# EAGLE design 32u4 denemesi (EAGLE 7.6.0)
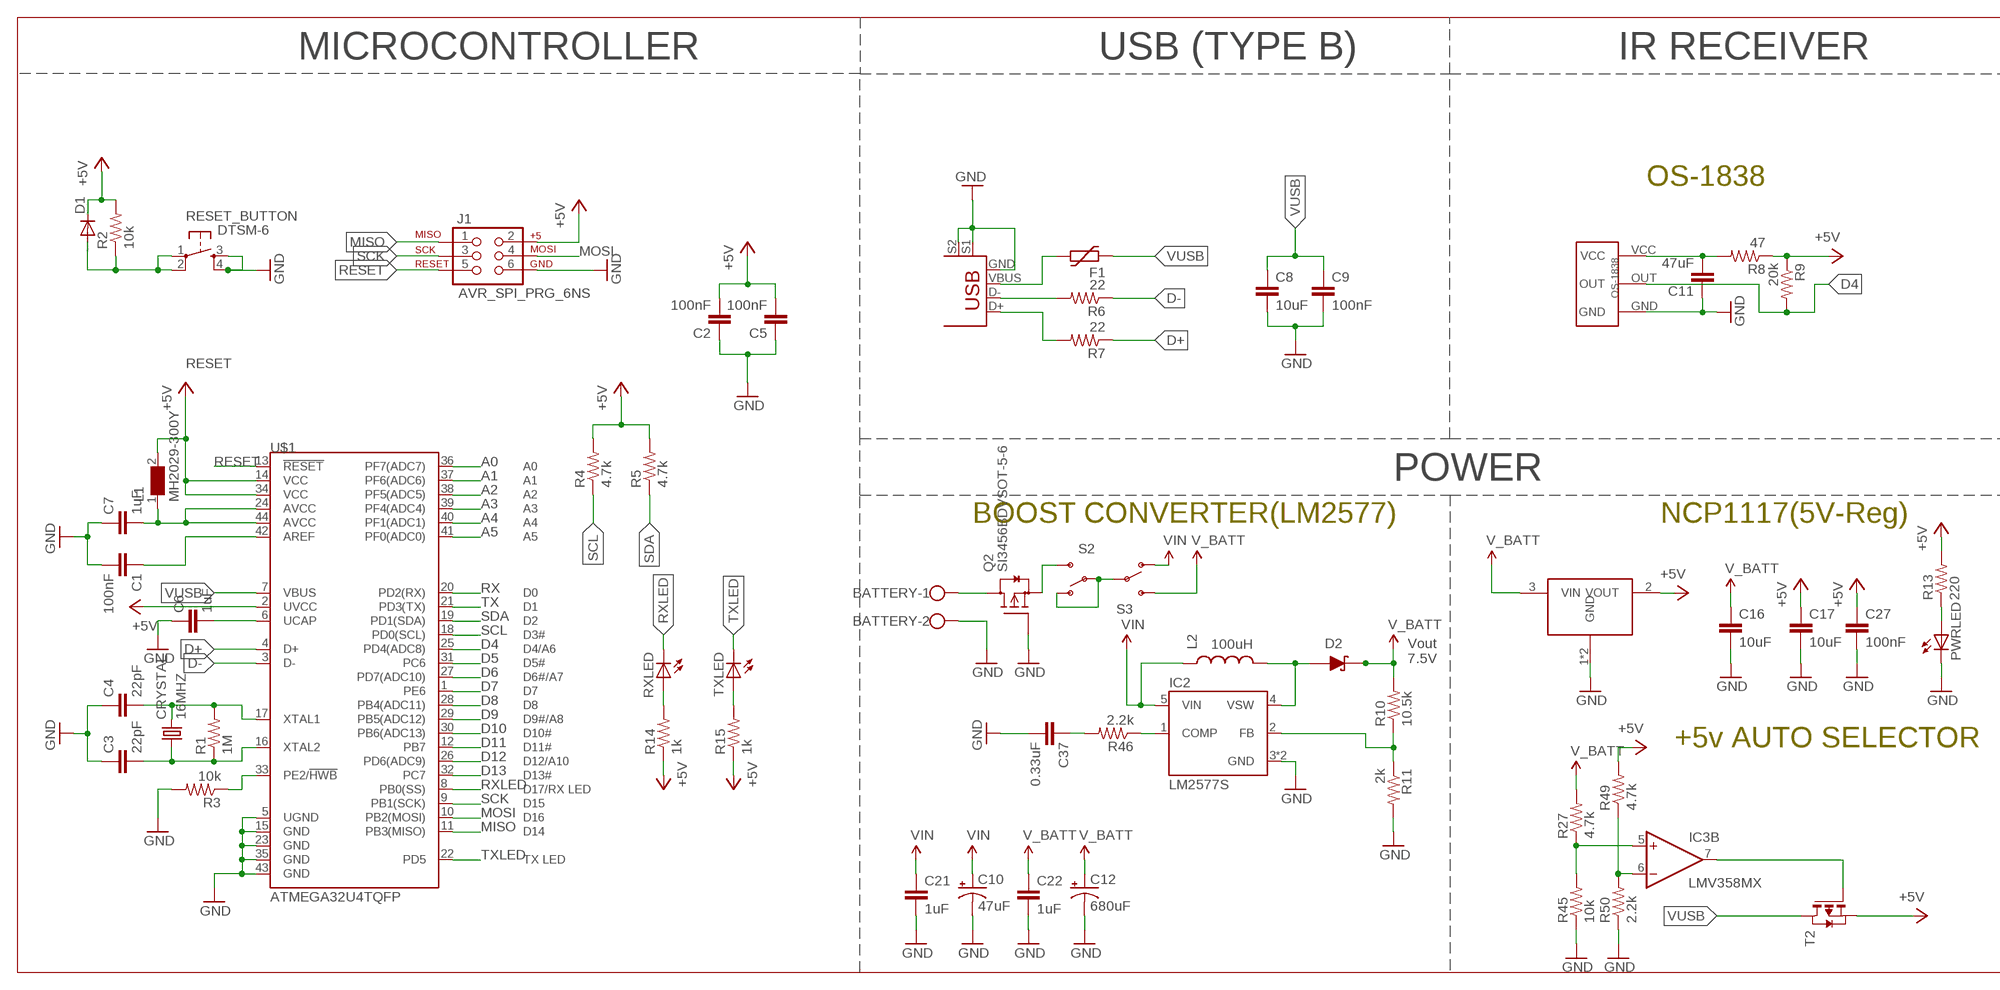
[diagram p0: schematic, sheet 1, part 1 of 2]
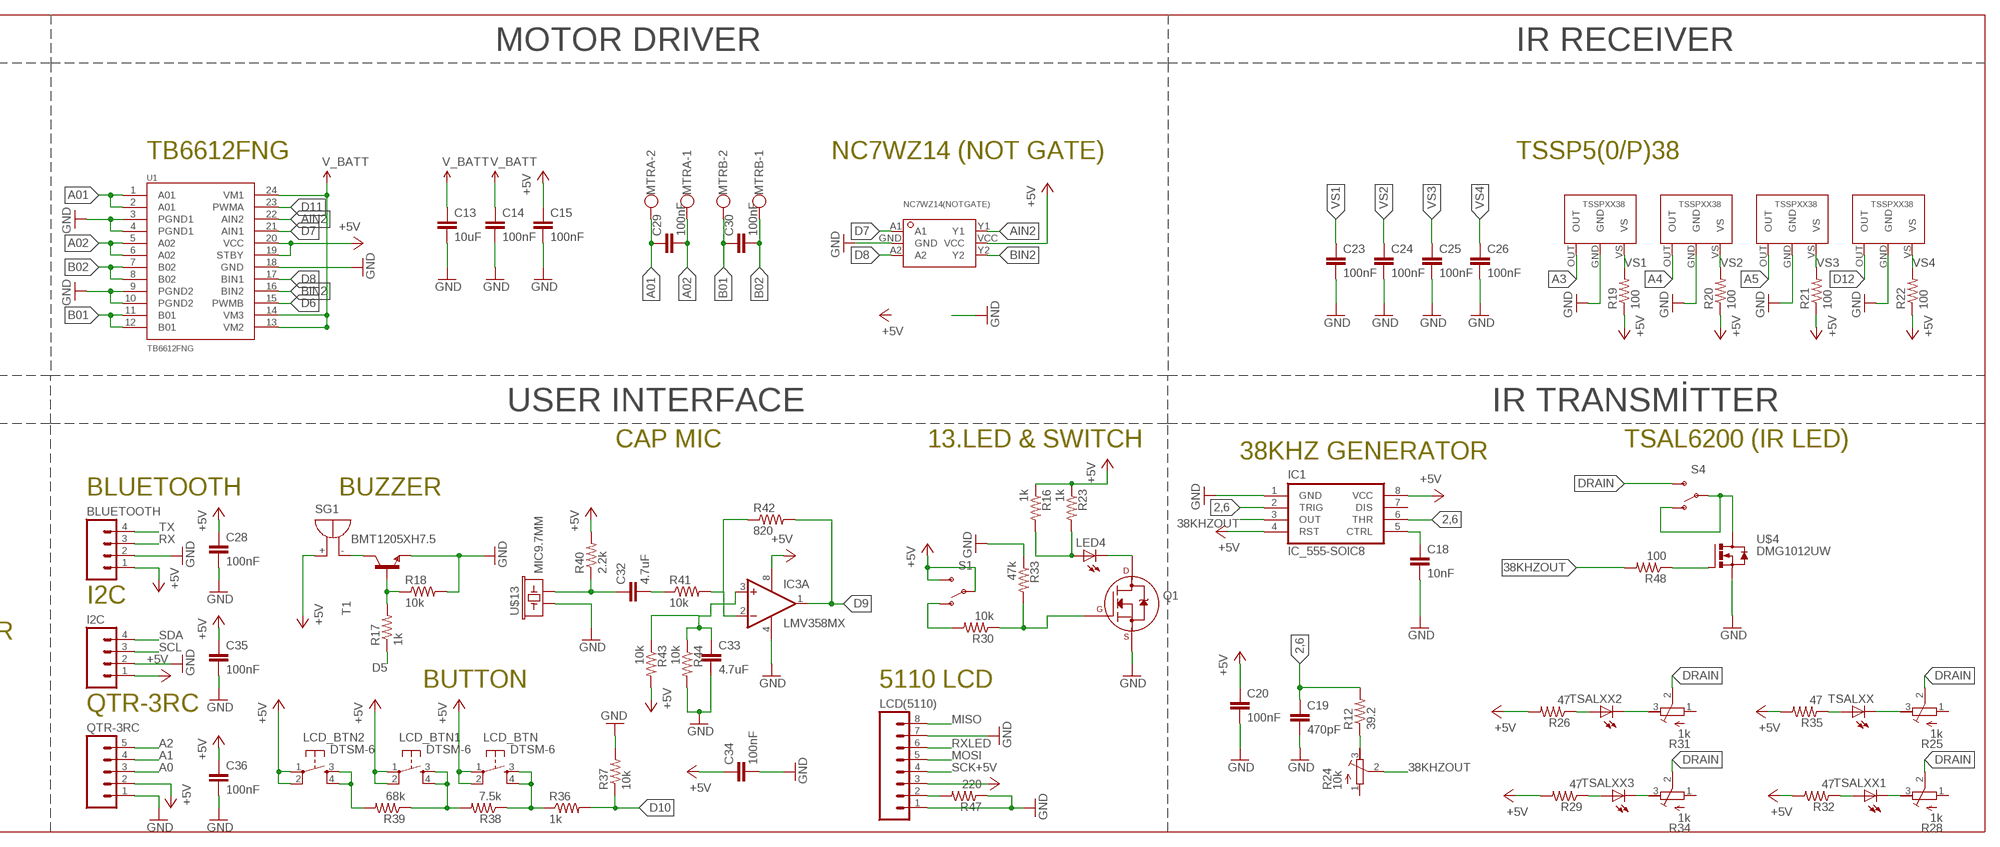
[diagram p1: schematic, sheet 1, part 2 of 2]

## Parts
BATTERY  W237-102  [W237-102]
BLUETOOTH  M04PTH  [1X04]
C1  100nF  CAP1206  [1206]
C2  100nF  CAP1206  [1206]
C3  22pF  CAP1206  [1206]
C4  22pF  CAP1206  [1206]
C5  100nF  CAP1206  [1206]
C6  1uF  CAP1206  [1206]
C7  1uF  CAP1206  [1206]
C8  10uF  CAP1206  [1206]
C9  100nF  CAP1206  [1206]
C10  47uF  CAP_POLF80  [NIPPON_F80]
C11  47uF  CAP1206  [1206]
C12  680uF  CAP_POLG  [PANASONIC_G]
C13  10uF  CAP1206  [1206]
C14  100nF  CAP1206  [1206]
C15  100nF  CAP1206  [1206]
C16  10uF  CAP1206  [1206]
C17  10uF  CAP1206  [1206]
C18  10nF  CAP1206  [1206]
C19  470pF  CAP1206  [1206]
C20  100nF  CAP1206  [1206]
C21  1uF  CAP1206  [1206]
C22  1uF  CAP1206  [1206]
C23  100nF  CAP1206  [1206]
C24  100nF  CAP1206  [1206]
C25  100nF  CAP1206  [1206]
C26  100nF  CAP1206  [1206]
C27  100nF  CAP1206  [1206]
C28  100nF  CAP1206  [1206]
C29  100nF  CAP1206  [1206]
C30  100nF  CAP1206  [1206]
C32  4.7uF  CAP1206  [1206]
C33  4.7uF  CAP1206  [1206]
C34  100nF  CAP1206  [1206]
C35  100nF  CAP1206  [1206]
C36  100nF  CAP1206  [1206]
C37  0.33uF  CAP1206  [1206]
CRYSTAL  16MHZ  CRYSTAL5X3  [CRYSTAL-SMD-5X3]
D1  DIODE-MINIMELF  [MINIMELF]
D2  D_SCHOTTKYA  [SMA]
F1  FUSE_PTC-0805  [PTC0805]
I2C  M04PTH  [1X04]
IC1  IC_555-SOIC8  [SOIC-8]
IC2  LM2577S  [TO263-5]
IC3  LMV358MX  [SO08]
J1  AVR_SPI_PRG_6NS  [2X3-NS]
L1  MH2029-300Y  WE-CBF_0805  [0805]
L2  INDUCTORPWR  [CDRH125]
LCD(5110)  M081X08  [1X08]
LCD_BTN  DTSM-6  [DTSM-6]
LCD_BTN1  DTSM-6  [DTSM-6]
LCD_BTN2  DTSM-6  [DTSM-6]
LED4  LEDCHIPLED_0805  [CHIPLED_0805]
MTRA  W237-102  [W237-102]
MTRB  W237-102  [W237-102]
PWRLED  LEDCHIPLED_0805  [CHIPLED_0805]
Q1  2N7000_SOT23  [SOT-23]
Q2  SI3456BDVSOT-5-6  [SOT23-6]
QTR-3RC  M05PTH  [1X05]
R1  1M  RESISTOR1206  [1206]
R2  10k  RESISTOR1206  [1206]
R3  10k  RESISTOR1206  [1206]
R4  4.7k  RESISTOR1206  [1206]
R5  4.7k  RESISTOR1206  [1206]
R6  22  RESISTOR1206  [1206]
R7  22  RESISTOR1206  [1206]
R8  47  RESISTOR1206  [1206]
R9  20k  RESISTOR1206  [1206]
R10  10.5k  RESISTOR1206  [1206]
R11  2k  RESISTOR1206  [1206]
R12  39.2  RESISTOR1206  [1206]
R13  220  RESISTOR1206  [1206]
R14  1k  RESISTOR1206  [1206]
R15  1k  RESISTOR1206  [1206]
R16  1k  RESISTOR1206  [1206]
R17  1k  RESISTOR1206  [1206]
R18  10k  RESISTOR1206  [1206]
R19  100  RESISTOR1206  [1206]
R20  100  RESISTOR1206  [1206]
R21  100  RESISTOR1206  [1206]
R22  100  RESISTOR1206  [1206]
R23  1k  RESISTOR1206  [1206]
R24  10k  R-TRIMM3296W  [RTRIM3296W]
R25  1k  R-TRIMM3296W  [RTRIM3296W]
R26  47  RESISTOR1206  [1206]
R27  4.7k  RESISTOR1206  [1206]
R28  1k  R-TRIMM3296W  [RTRIM3296W]
R29  47  RESISTOR1206  [1206]
R30  10k  RESISTOR1206  [1206]
R31  1k  R-TRIMM3296W  [RTRIM3296W]
R32  47  RESISTOR1206  [1206]
R33  47k  RESISTOR1206  [1206]
R34  1k  R-TRIMM3296W  [RTRIM3296W]
R35  47  RESISTOR1206  [1206]
R36  1k  RESISTOR1206  [1206]
R37  10k  RESISTOR1206  [1206]
R38  7.5k  RESISTOR1206  [1206]
R39  68k  RESISTOR1206  [1206]
R40  2.2k  RESISTOR1206  [1206]
R41  10k  RESISTOR1206  [1206]
R42  820  RESISTOR1206  [1206]
R43  10k  RESISTOR1206  [1206]
R44  10k  RESISTOR1206  [1206]
R45  10k  RESISTOR1206  [1206]
R46  2.2k  RESISTOR1206  [1206]
R47  220  RESISTOR1206  [1206]
R48  100  RESISTOR1206  [1206]
R49  4.7k  RESISTOR1206  [1206]
R50  2.2k  RESISTOR1206  [1206]
RESET_BUTTON  DTSM-6  [DTSM-6]
RXLED  LEDCHIPLED_0805  [CHIPLED_0805]
S1  SWITCH-SPDTPTH  [SWITCH-SPDT]
S2  SWITCH-SPDTPTH  [SWITCH-SPDT]
S3  SWITCH-SPDTPTH  [SWITCH-SPDT]
S4  SWITCH-SPDTPTH  [SWITCH-SPDT]
SG1  BMT1205XH7.5  [BMT1205XH7.5]
T1  MMBT2222ALT1-NPN-SOT23-BEC  [SOT23-BEC]
T2  PMOSSOT23  [SOT-23]
TSALXX  LED5MM  [LED5MM]
TSALXX1  LED5MM  [LED5MM]
TSALXX2  LED5MM  [LED5MM]
TSALXX3  LED5MM  [LED5MM]
TXLED  LEDCHIPLED_0805  [CHIPLED_0805]
U1  TB6612FNG  TB6621FNG  [SSOP24]
U$1  ATMEGA32U4TQFP  [SPARKFUN-DIGITALIC_TQFP44]
U$2  USB+SHIELD  [USB-B-PTH]
U$3  OS-1838  [OS-1838]
U$4  DMG1012UW  [SOT323]
U$5  NCP1117  [SOT223]
U$6  TSSPXX38  [TSSPXX38]
U$7  TSSPXX38  [TSSPXX38]
U$8  TSSPXX38  [TSSPXX38]
U$9  TSSPXX38  [TSSPXX38]
U$10  NC7WZ14(NOTGATE)  [SC-70-6]
U$13  MIC9.7MM  [MIC-9.7MM]

## Nets
2,6: C19.1 IC1.2(TRIG) IC1.6(THR) R12.2
38KHZOUT: IC1.3(OUT) R24.2(S) R48.2
+5V: BLUETOOTH.1 C2.2 C5.2 C15.1 C17.1 C20.1 C27.1 C28.1 C34.1 C35.1 C36.1 D1.C I2C.1 IC1.4(RST) IC1.8(VCC) IC3.8(P:V+) J1.2 L1.2 LCD(5110).3 LCD_BTN1.1 LCD_BTN1.2 LCD_BTN2.1 LCD_BTN2.2 LCD_BTN.1 LCD_BTN.2 QTR-3RC.2 R2.2 R4.2 R5.2 R8.1 R9.1 R13.2 R14.1 R15.1 R16.1 R19.1 R20.1 R21.1 R22.1 R23.1 R26.2 R29.2 R32.2 R35.2 R40.2 R43.2 R49.2 S1.2(P) S1.3(S) SG1.+ T2.2(S) U1.19(STBY) U1.20(VCC) U$1.2(UVCC) U$1.14(VCC) U$1.34(VCC) U$5.2(VOUT) U$10.VCC
A0: QTR-3RC.3 U$1.36(PF7(ADC7))
A1: QTR-3RC.4 U$1.37(PF6(ADC6))
A01 [supply]: C29.1 MTRA.2 U1.1(A01) U1.2(A01)
A2: QTR-3RC.5 U$1.38(PF5(ADC5))
A02 [supply]: C29.2 MTRA.1 U1.5(A02) U1.6(A02)
A3: U$1.39(PF4(ADC4)) U$9.OUT
A4: U$1.40(PF1(ADC1)) U$8.OUT
A5: U$1.41(PF0(ADC0)) U$7.OUT
AIN2: U1.22(AIN2) U$10.Y1
B01 [supply]: C30.1 MTRB.2 U1.11(B01) U1.12(B01)
B02 [supply]: C30.2 MTRB.1 U1.7(B02) U1.8(B02)
BIN2: U1.16(BIN2) U$10.Y2
CTRL: C18.1 IC1.5(CTRL)
D4: R9.2 U$1.25(PD4(ADC8)) U$3.OUT
D5: R17.1 U$1.31(PC6)
D6: U1.15(PWMB) U$1.27(PD7(ADC10))
D7: U1.21(AIN1) U$1.1(PE6) U$10.A1
D8: U1.17(BIN1) U$1.28(PB4(ADC11)) U$10.A2
D9: IC3.1(A:OUT) R42.2 U$1.29(PB5(ADC12))
D10: R36.2 R37.1 U$1.30(PB6(ADC13))
D11: U1.23(PWMA) U$1.12(PB7)
D12: U$1.26(PD6(ADC9)) U$6.OUT
D13: U$1.32(PC7)
D+: R7.1 U$1.4(D+)
D-: R6.1 U$1.3(D-)
DRAIN: R25.2(S) R28.2(S) R31.2(S) R34.2(S) S4.3(S)
GND: BATTERY.2 BLUETOOTH.2 C1.2 C2.1 C3.1 C4.1 C5.1 C6.1 C7.1 C8.2 C9.2 C10.- C11.1 C12.- C13.2 C14.2 C15.2 C16.2 C17.2 C18.2 C19.2 C20.2 C21.2 C22.2 C23.2 C24.2 C25.2 C26.2 C27.2 C28.2 C33.2 C34.2 C35.2 C36.2 C37.2 I2C.2 IC1.1(GND) IC2.3(GND) IC2.6(GND) IC3.4(P:V-) J1.6 LCD(5110).1 LCD(5110).7 PWRLED.C Q1.2(S) Q2.3(G) QTR-3RC.1 R3.2 R11.2 R18.2 R33.1 R37.2 R44.2 R45.1 R47.1 R50.1 RESET_BUTTON.3 RESET_BUTTON.4 T1.E U1.3(PGND1) U1.4(PGND1) U1.9(PGND2) U1.10(PGND2) U1.18(GND) U$1.5(UGND) U$1.15(GND) U$1.23(GND) U$1.35(GND) U$1.43(GND) U$2.GND U$2.S1 U$2.S2 U$3.GND U$4.2(S) U$5.1(GND) U$5.4(GND) U$6.GND U$7.GND U$8.GND U$9.GND U$10.GND U$13.1
MISO: J1.1 LCD(5110).8 U$1.11(PB3(MISO))
MOSI: J1.4 LCD(5110).5 U$1.10(PB2(MOSI))
N$1 [supply]: C7.2 L1.1 U$1.24(AVCC) U$1.44(AVCC)
N$2: C1.1 U$1.42(AREF)
N$3 [supply]: C6.2 U$1.6(UCAP)
N$4: C4.2 CRYSTAL.3 R1.2 U$1.17(XTAL1)
N$5: C3.2 CRYSTAL.1 R1.1 U$1.16(XTAL2)
N$6: F1.2 U$2.VBUS
N$7: R3.1 U$1.33(PE2/!HWB)
N$8: LCD_BTN2.3 LCD_BTN2.4 R39.2
N$9: R6.2 U$2.D-
N$10: R7.2 U$2.D+
N$11: IC3.5(B:+IN) R27.1 R45.2
N$12: C11.2 R8.2 U$3.VCC
N$14: PWRLED.A R13.1
N$15 [supply]: IC2.2(FB) R10.1 R11.1
N$16: R48.1 U$4.1(G)
N$17: LCD_BTN.3 LCD_BTN.4 R36.1 R38.1
N$18: LCD_BTN1.3 LCD_BTN1.4 R38.2 R39.1
N$19: C32.1 R40.1 U$13.2
N$20: C32.2 R41.1
N$21: IC3.2(A:-IN) R41.2 R42.1
N$22: R14.2 RXLED.A
N$23: R15.2 TXLED.A
N$24: LED4.A R16.2 R23.2
N$25: R17.2 R18.1 T1.B
N$26: IC3.6(B:-IN) R49.1 R50.2
N$27: SG1.- T1.C
N$28: IC3.7(B:OUT) T2.3(G)
N$29: R12.1 R24.3(A)
N$31: S4.1(O) S4.2(P) U$4.3(D)
N$33: R25.3(A) TSALXX.K(C)
N$34: R35.1 TSALXX.A
N$35: LED4.C Q1.3(D)
N$37: R28.3(A) TSALXX1.K(C)
N$38: R32.1 TSALXX1.A
N$39: R30.2 S1.1(O)
N$40: Q1.1(G) R30.1 R33.2
N$41: R31.3(A) TSALXX2.K(C)
N$42: R26.1 TSALXX2.A
N$45: R34.3(A) TSALXX3.K(C)
N$46: R29.1 TSALXX3.A
N$49: BATTERY.1 Q2.1(D) Q2.2(D) Q2.5(D) Q2.6(D)
N$50: C33.1 IC3.3(A:+IN) R43.1 R44.1
N$51: Q2.4(S) S2.3(S)
N$52 [supply]: IC2.1(COMP) R46.1
N$53: C37.1 R46.2
N$54 [supply]: S2.1(O) S2.2(P) S3.2(P)
N$55: LCD(5110).2 R47.2
RESET: D1.A J1.5 R2.1 RESET_BUTTON.1 RESET_BUTTON.2 U$1.13(!RESET)
RX: BLUETOOTH.3 U$1.20(PD2(RX))
RXLED: LCD(5110).6 RXLED.C U$1.8(PB0(SS))
SCK: J1.3 LCD(5110).4 U$1.9(PB1(SCK))
SCL: I2C.3 R4.1 U$1.18(PD0(SCL))
SDA: I2C.4 R5.1 U$1.19(PD1(SDA))
TX: BLUETOOTH.4 U$1.21(PD3(TX))
TXLED: TXLED.C U$1.22(PD5)
V_BATT [supply]: C12.+ C13.1 C14.1 C16.1 C22.1 D2.1(C) R10.2 R27.2 S3.3(S) U1.13(VM2) U1.14(VM3) U1.24(VM1) U$5.3(VIN)
VIN [supply]: C10.+ C21.1 IC2.5(VIN) L2.1 S3.1(O)
VS1: C23.1 R19.2 U$9.VS
VS2: C24.1 R20.2 U$8.VS
VS3: C25.1 R21.2 U$7.VS
VS4: C26.1 R22.2 U$6.VS
VSW [supply]: D2.2(A) IC2.4(VSW) L2.2
VUSB [supply]: C8.1 C9.1 F1.1 T2.1(D) U$1.7(VBUS)
Unconnected: IC1.7(DIS) R24.1(E) R25.1(E) R28.1(E) R31.1(E) R34.1(E)

## Notes on the sheet
- MICROCONTROLLER | USB (TYPE B) | IR RECEIVER | MOTOR DRIVER | IR RECEIVER
- OS-1838 | TB6612FNG | NC7WZ14 (NOT GATE) | TSSP5(0/P)38
- POWER | USER INTERFACE | IR TRANSMİTTER
- BOOST CONVERTER(LM2577) | NCP1117(5V-Reg) | CAP MIC | 13.LED & SWITCH | TSAL6200 (IR LED)
- 38KHZ GENERATOR
- BLUETOOTH | BUZZER
- 100uH
- Vout
  7.5V
- I2C
- +5v AUTO SELECTOR
- BUTTON | 5110 LCD
- QTR-3RC

## Library data of the parts
BATTERY MTRA MTRB = con-wago-500:W237-102: WAGO SCREW CLAMP; MPN: 237-102; OC_FARNELL: unknown; OC_NEWARK: 70K9898
BLUETOOTH I2C = SparkFun-Connectors:M04: Header 4 Standard 4-pin 0.1" header. Use with straight break away headers (SKU : PRT-00116), right angle break away headers (PRT-00553), swiss pins (PRT-00743), machine pins (PRT-00117), and female headers (PRT-00115). Molex polarized connector foot print use with SKU : PRT-08231 with associated crimp pins and housings. 1MM SMD Version SKU: PRT-10208
C1-C9 C11 C13-C30 C32-C37 = SparkFun-Passives:CAP: Capacitor Standard 0603 ceramic capacitor, and 0.1" leaded capacitor.
C10 C12 = SparkFun-Passives:CAP_POL: Capacitor Polarized These are standard SMD and PTH capacitors. Normally 10uF, 47uF, and 100uF in electrolytic and tantalum varieties. Always verify the external diameter of the through hole cap, it varies with capacity, voltage, and manufacturer. The EIA devices should be standard.
CRYSTAL = SparkFun-FreqCtrl:CRYSTAL: Various standard crystals. Proven footprints. Spark Fun Electronics SKU : COM-00534
D1 = diode:DIODE-: DIODE
D2 = m-pad-2.1:D_SCHOTTKY: Schottky diodes in various packages
F1 = dp_devices:FUSE_PTC: Resettable PTC
IC1 = dp_devices:IC_555: Classic 555 IC
IC2 = v-reg-3:LM2577: National Semiconductor <http://www.national.com> 3.0A Step-Up "Simple Switcher"(c) 3.0A 65V NPN switch, step-up regulator
IC3 = linear:LMV358?*: Dual General Purpose, Low Voltage, Rail-to-Rail Output Operational Amplifiers Source: http://www.national.com/mpf/LM/LMV321.html http://www.national.com/dt/lmv_qual.pdf
J1 = SparkFun-Connectors:AVR_SPI_PRG_6: AVR ISP 6 Pin This is the reduced ISP connector for AVR programming. Common on Arduino. This footprint will take up less PCB space and can be used with a 10-pin to 6-pin adapter such as SKU: BOB-08508
L1 = wuerth_elektronik_v5:WE-CBF: SMD EMI Suppression Ferrite Beads - excellent anti-EMI properties - low DCR - impedances till 3000 ohms - rated current up to 6 A
L2 = SparkFun-Passives:INDUCTOR: Inductors Basic Inductor/Choke - 0603 and 1206. Footprints are not proven and vary greatly between part numbers. SRN6045- 33uH, 20% 1.4A SDR0403-560KL - 56uH, 10%, 500mA RMS/740mA peak
LCD(5110) = SparkFun-Connectors:M08: Header 8 Standard 8-pin 0.1" header. Use with straight break away headers (SKU : PRT-00116), right angle break away headers (PRT-00553), swiss pins (PRT-00743), machine pins (PRT-00117), and female headers (PRT-00115).
LCD_BTN LCD_BTN1 LCD_BTN2 RESET_BUTTON = switch-tact:DTSM-6
LED4 PWRLED RXLED TSALXX TSALXX1-TSALXX3 TXLED = led:LED: LED OSRAM: - CHIPLED LG R971, LG N971, LY N971, LG Q971, LY Q971, LO R971, LY R971 LH N974, LH R974 LS Q976, LO Q976, LY Q976 LO Q996 - Hyper CHIPLED LW Q18S LB Q993, LB Q99A, LB R99A - SideLED LS A670, LO A670, LY A670, LG A670, LP A670 LB A673, LV A673, LT A673, LW A673 LH A674 LY A675 LS A676, LA A676, LO A676, LY A676, LW A676 LS A679, LY A679, LG A679 - Hyper Micro SIDELED® LS Y876, LA Y876, LO Y876, LY Y876 LT Y87S - SmartLED LW L88C, LW L88S LB L89C, LB L89S, LG L890 LS L89K, LO L89K, LY L89K LS L896, LA L896, LO L896, LY L896 - TOPLED LS T670, LO T670, LY T670, LG T670, LP T670 LSG T670, LSP T670, LSY T670, LOP T670, LYG T670 LG T671, LOG T671, LSG T671 LB T673, LV T673, LT T673, LW T673 LH T674 LS T676, LA T676, LO T676, LY T676, LB T676, LH T676, LSB T676, LW T676 LB T67C, LV T67C, LT T67C, LS T67K, LO T67K, LY T67K, LW E67C LS E67B, LA E67B, LO E67B, LY E67B, LB E67C, LV E67C, LT E67C LW T67C LS T679, LY T679, LG T679 LS T770, LO T770, LY T770, LG T770, LP T770 LB T773, LV T773, LT T773, LW T773 LH T774 LS E675, LA E675, LY E675, LS T675 LS T776, LA T776, LO T776, LY T776, LB T776 LHGB T686 LT T68C, LB T68C - Hyper Mini TOPLED® LB M676 - Mini TOPLED Santana® LG M470 LS M47K, LO M47K, LY M47K Source: http://www.osram.convergy.de LUXEON: - LUMILED® LXK2-PW12-R00, LXK2-PW12-S00, LXK2-PW14-U00, LXK2-PW14-V00 LXK2-PM12-R00, LXK2-PM12-S00, LXK2-PM14-U00 LXK2-PE12-Q00, LXK2-PE12-R00, LXK2-PE12-S00, LXK2-PE14-T00, LXK2-PE14-U00 LXK2-PB12-K00, LXK2-PB12-L00, LXK2-PB12-M00, LXK2-PB14-N00, LXK2-PB14-P00, LXK2-PB14-Q00 LXK2-PR12-L00, LXK2-PR12-M00, LXK2-PR14-Q00, LXK2-PR14-R00 LXK2-PD12-Q00, LXK2-PD12-R00, LXK2-PD12-S00 LXK2-PH12-R00, LXK2-PH12-S00 LXK2-PL12-P00, LXK2-PL12-Q00, LXK2-PL12-R00 Source: www.luxeon.com KINGBRIGHT: KA-3528ASYC Source: www.kingbright.com
Q1 = transistors:2N700*: 2N7000, 2N7002, NDS7002A N-channel enhancement mode MOSFET
Q2 = m-pad-2.1:SI3456BDV: Vishay Siliconix Si3456BDVY N-Channel 30-V (D-S) MOSFET FEATURES: TrenchFET Power MOSFET 100% Rg Tested Please send any comments to: messi@users.sourceforge.net
QTR-3RC = SparkFun-Connectors:M05: Header 5 Standard 5-pin 0.1" header. Use with straight break away headers (SKU : PRT-00116), right angle break away headers (PRT-00553), swiss pins (PRT-00743), machine pins (PRT-00117), and female headers (PRT-00115). Molex polarized connector foot print use with SKU : PRT-08230 with associated crimp pins and housings.
R1-R23 R26 R27 R29 R30 R32 R33 R35-R50 = SparkFun-Resistors:RESISTOR: Resistor Basic schematic elements and footprints for 0603, 1206, and PTH resistors.
R24 R25 R28 R31 R34 = resistor:R-TRIMM: Trimm resistor
S1-S4 = SparkFun-Electromechanical:SWITCH-SPDT: SPDT Switch Simple slide switch, Spark Fun Electronics SKU : COM-00102 DPDT SMT slide switch, AYZ0202, SWCH-08179
SG1 = buzzer:BMT1205XH7.5: MAGNETIC TRANSDUCER Source: Http:www.be-star.com; OC_FARNELL: unknown; OC_NEWARK: unknown
T1 = transistor:*-NPN-: NPN Transistror BF959 corrected 2008.03.06
T2 = zetex:PMOSSOT23: MOS FET; OC_FARNELL: unknown; OC_NEWARK: unknown
U1 = SparkFun-PowerIC:TB6621FNG: Toshiba 1A dual motor driver IC-09363; PROD_ID: IC-09363
U$1 = SparkFun-DigitalIC:ATMEGA32U4: Atmel 44-pin 8-bit Microcontroller with 32KBytes of ISP Flash and USB Controller ----- Please use the QFN-44-NOPAD_1:1 package for the footprint of all boards using a 32U4. Route traces directly away from the pads as much as possible.; PROD_ID: IC-11161
U$2 = SparkFun-Connectors:USB+SHIELD: USB+Shield USB connector with shield pins connectable
U$3 = HACIBİDEAS:OS-1838
U$4 = m-pad-2.1:DMG1012UW
U$5 = SparkFun-PowerIC:NCP1117
U$6-U$9 = HACIBİDEAS:TSSPXX38
U$10 = m-pad-2.1:NC7WZ14(NOTGATE)
U$13 = SparkFun-Sensors:MIC: Omni-directional electret microphone. 9.7mm standard diameter.; PROD_ID: COMP-08856

## Module TSSSP
Ports: 

### Library data of the parts

## Net classes
0 default: width 0.406 mm, drill 0.254 mm, clearance 0.203 mm
1 supply: width 0.406 mm, drill 0.254 mm, clearance 0.203 mm

## Board
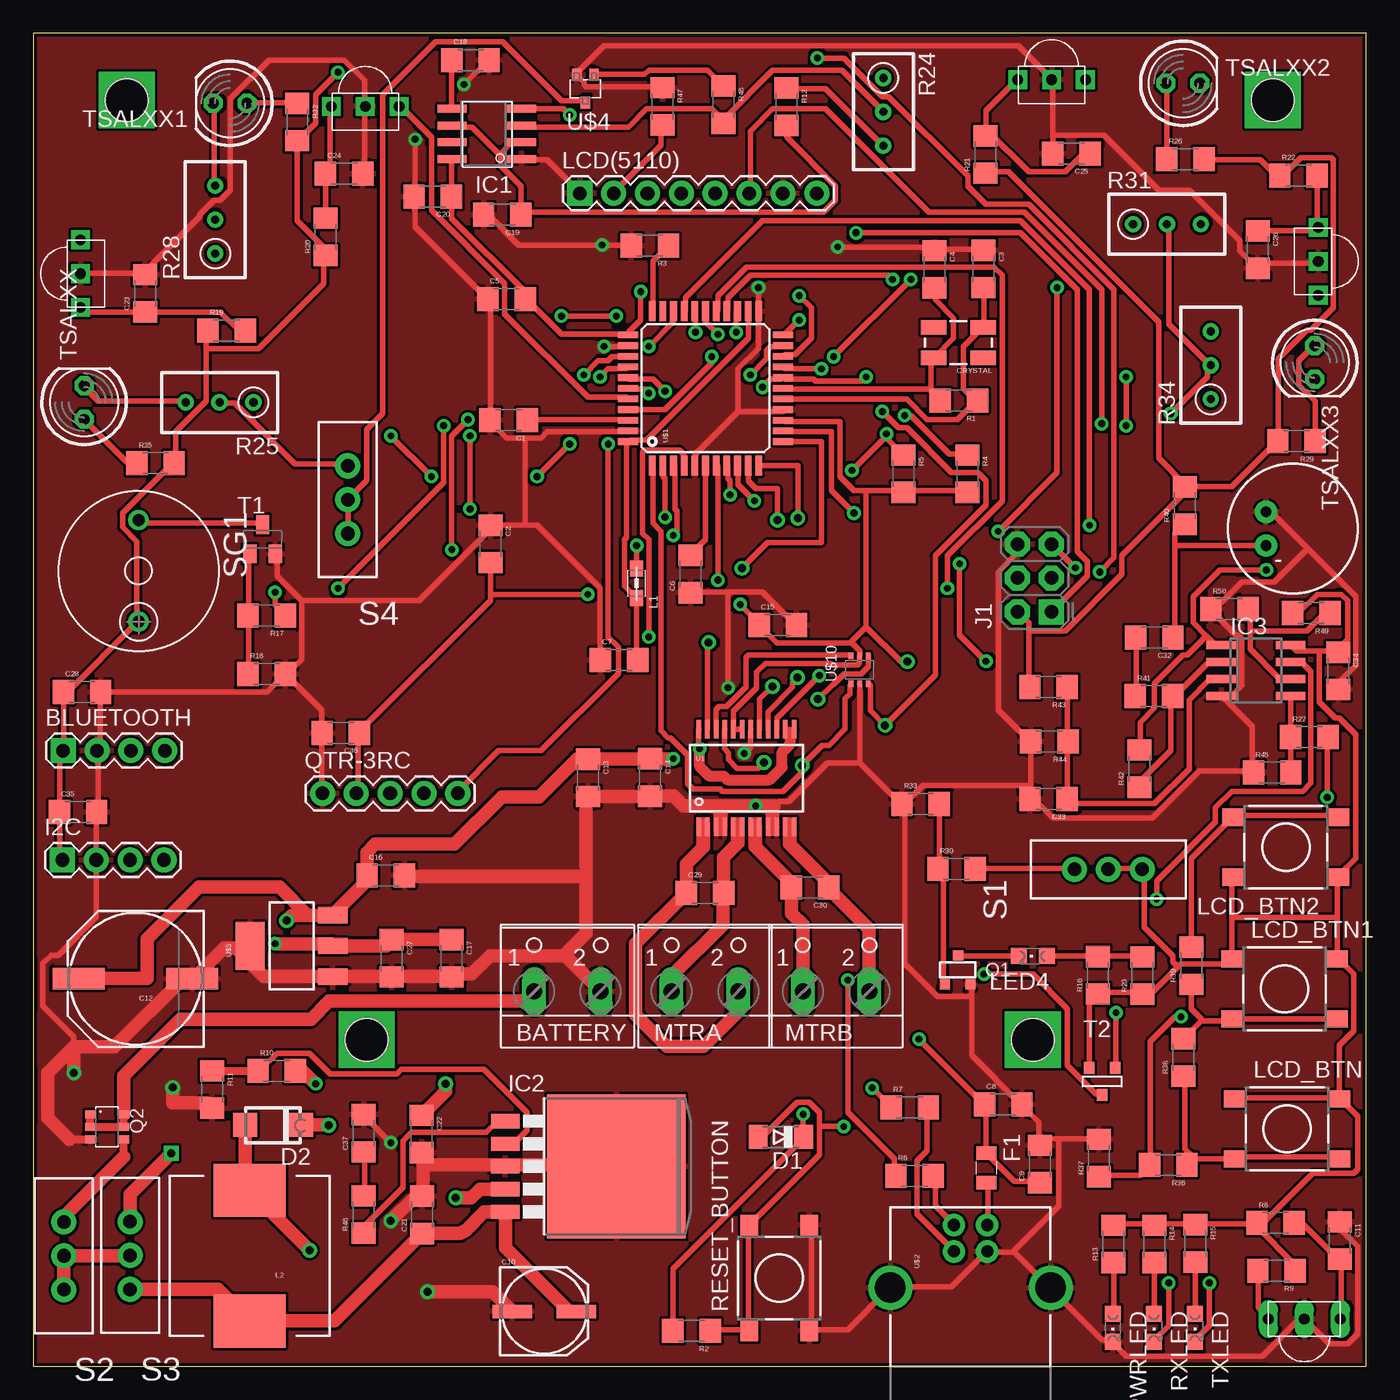
[diagram p2: board, top side]
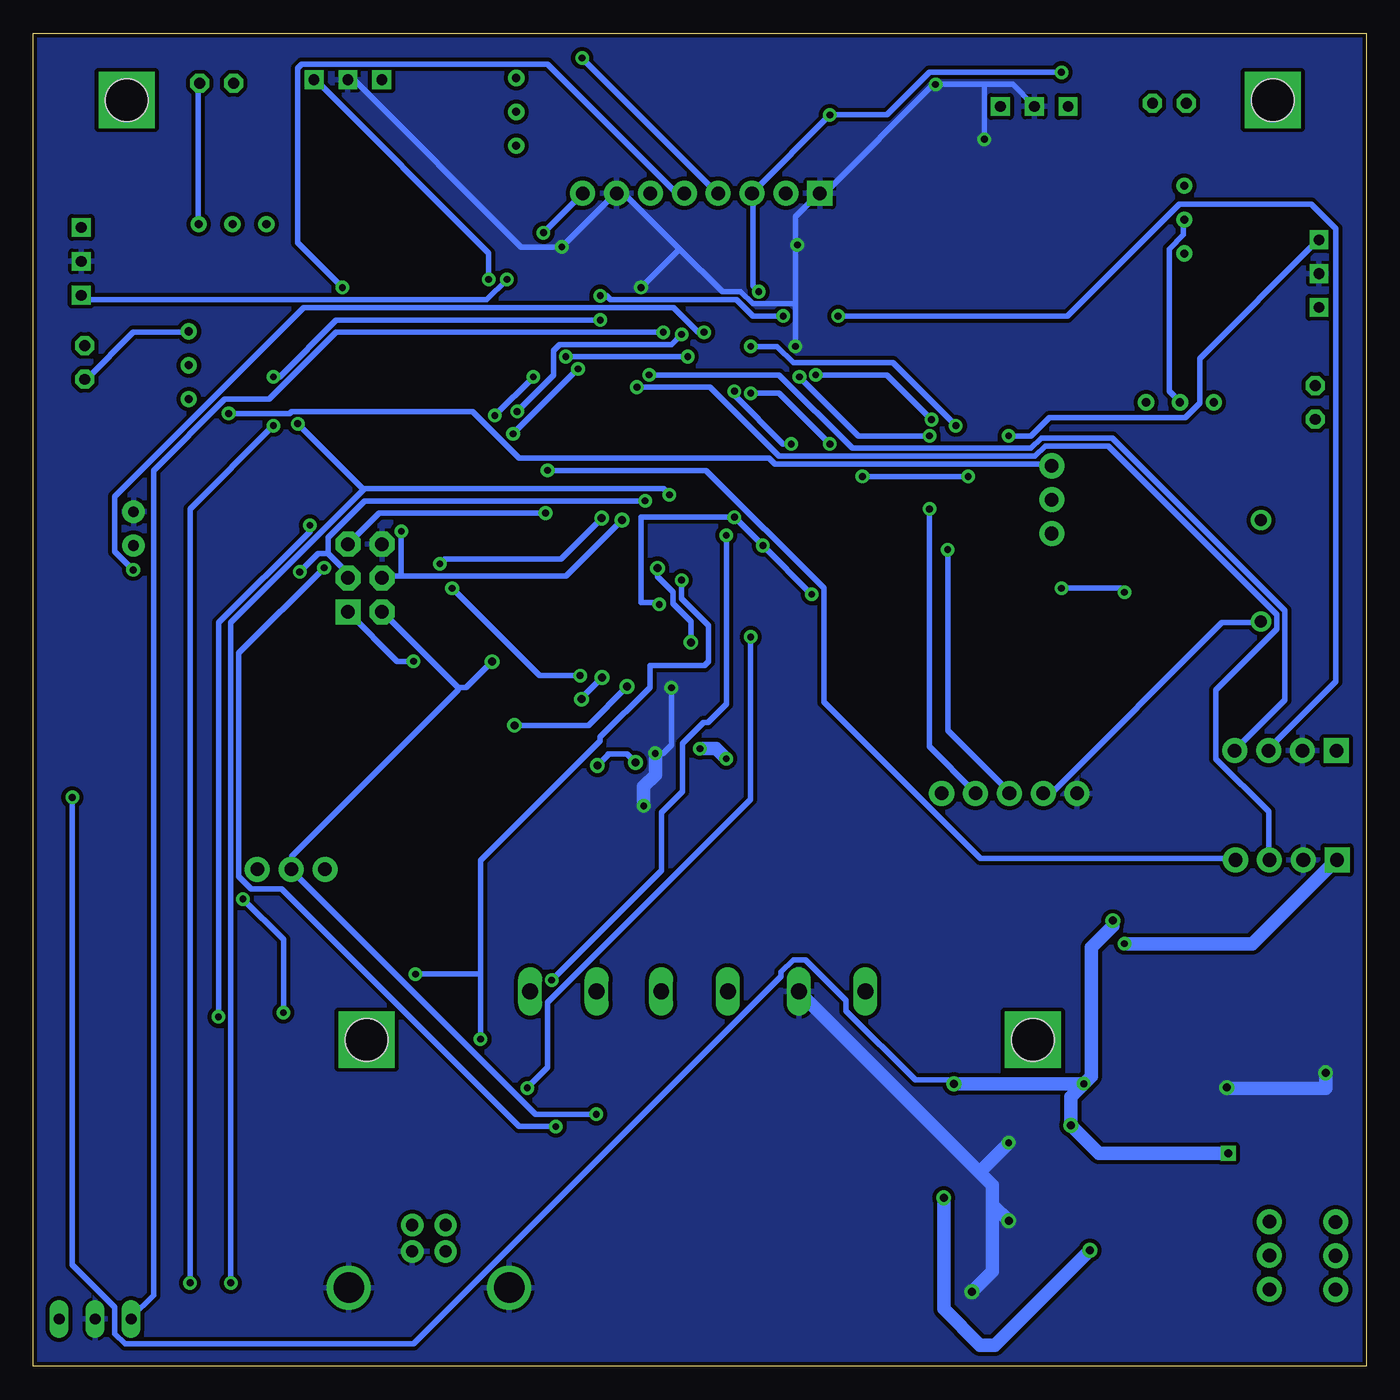
[diagram p3: board, bottom side, seen from below]

Size 100 x 100 mm. Coordinates in mm from the lower left corner, seen from the top.
Outline: 0,0 100,0 100,100 0,100 0,0
Copper layers (1*16): Top 0.035mm / dielectric 1.5mm / Bottom 0.035mm
Design rules "SparkFun": minimum track width 8mil, minimum drill 20mil, track to track 8mil, track to pad 8mil, pad to pad 8mil, via to via 8mil, smd to smd 8mil, copper to edge 10mil, drill to drill 8mil, minimum pad ring 12mil, minimum via ring 10mil, stop-mask expansion 4mil, vias tented up to drill 25mil, thermal gap 10mil
Holes 3.2 mm at 7,95 93,95 25,24.5 75,24.5

### Footprints (pad centres in the part's own frame; a part is rotated, then mirrored left to right if it is on the bottom)
W237-102 = drill 1.194 long: 1 -2.5,-1.27; 2 2.5,-1.27
1X04 = drill 1.016 pad 1.88 square: 1 0,0 | drill 1.016 pad 1.88: 2 2.54,0; 3 5.08,0; 4 7.62,0
1206 = smd 1.6 x 1.8: 1 -1.4,0; 2 1.4,0
NIPPON_F80 = smd 2.95 x 1: + 2.4,0; - -2.4,0
PANASONIC_G = smd 3.9 x 1.6: + 4.25,0; - -4.25,0
CRYSTAL-SMD-5X3 = smd 1.9 x 1.1: 1 -1.85,-1.15; 2 1.85,-1.15; 3 1.85,1.15; 4 -1.85,1.15
MINIMELF = smd 1.4 x 1.8: A 1.7,0; C -1.7,0
SMA = smd 1.8 x 1.8: 1 -2.1,-0.1; 2 2.1,-0.1
PTC0805 = smd 1 x 1.5: 1 -1.1,0; 2 1.1,0
SOIC-8 = smd 0.6 x 2.2: 1 -1.905,-2.6; 2 -0.635,-2.6; 3 0.635,-2.6; 4 1.905,-2.6; 5 1.905,2.6; 6 0.635,2.6; 7 -0.635,2.6; 8 -1.905,2.6
TO263-5 = smd 1.067 x 2.159: 1 -3.404,-5.791; 2 -1.702,-5.791; 3 0,-5.791; 4 1.702,-5.791; 5 3.404,-5.791 | smd 10.8 x 10.41: 6 0,2.54
SO08 = smd 0.6 x 2.2: 1 -1.905,-2.6; 2 -0.635,-2.6; 3 0.635,-2.6; 4 1.905,-2.6; 5 1.905,2.6; 6 0.635,2.6; 7 -0.635,2.6; 8 -1.905,2.6
2X3-NS = drill 1.016 pad 1.88 square: 1 -2.54,-1.27 | drill 1.016 pad 1.88 octagon: 2 -2.54,1.27; 3 0,-1.27; 4 0,1.27; 5 2.54,-1.27; 6 2.54,1.27
0805 = smd 1.2 x 1: 1 -1.1,0; 2 1.1,0
CDRH125 = smd 5.4 x 4: 1 0,4.9; 2 0,-4.9
1X08 = drill 1.016 pad 1.88 square: 1 0,0 | drill 1.016 pad 1.88: 2 2.54,0; 3 5.08,0; 4 7.62,0; 5 10.16,0; 6 12.7,0; 7 15.24,0; 8 17.78,0
DTSM-6 = smd 1.55 x 1.3: 1 -3.975,2.25; 2 3.975,2.25; 3 -3.975,-2.25; 4 3.975,-2.25
CHIPLED_0805 = smd 1.2 x 1.2: A 0,-1.05; C 0,1.05
SOT-23 = smd 0.762 x 0.762: 1 -0.979,-1.101; 2 0.94,-1.101; 3 0.025,1.067
SOT23-6 = smd 0.6 x 0.8: 1 -0.95,-1.25; 2 0,-1.25; 3 0.95,-1.25; 4 0.95,1.25; 5 0,1.25; 6 -0.95,1.25
1X05 = drill 1.016 pad 1.88: 1 0,0; 2 2.54,0; 3 5.08,0; 4 7.62,0; 5 10.16,0
RTRIM3296W = drill 0.61: 1 0,-2.54; 2 0,0; 3 0,2.54
SWITCH-SPDT = drill 1.016 pad 1.88: 1 0,2.54; 2 0,0; 3 0,-2.54
BMT1205XH7.5 = drill 0.9 pad 1.5: + 3.8,0; - -3.8,0
SOT23-BEC = smd 1 x 1.4: B -0.95,-1.1; C 0,1.1; E 0.95,-1.1
SOT-23' = smd 0.787 x 0.889: 1 0.025,-1.016; 2 -0.94,1.016; 3 0.991,1.016
LED5MM = drill 0.813 octagon: A -1.27,0; K 1.27,0
SSOP24 = smd 0.348 x 1.397: 1 -3.575,-3.656; 2 -2.925,-3.656; 3 -2.275,-3.656; 4 -1.625,-3.656; 5 -0.975,-3.656; 6 -0.325,-3.656; 7 0.325,-3.656; 8 0.975,-3.656; 9 1.625,-3.656; 10 2.275,-3.656; 11 2.925,-3.656; 12 3.575,-3.656; 13 3.575,3.656; 14 2.925,3.656; 15 2.275,3.656; 16 1.625,3.656; 17 0.975,3.656; 18 0.325,3.656; 19 -0.325,3.656; 20 -0.975,3.656; 21 -1.625,3.656; 22 -2.275,3.656; 23 -2.925,3.656; 24 -3.575,3.656
SPARKFUN-DIGITALIC_TQFP44 = smd 1.5 x 0.5: 1 -5.8,4; 2 -5.8,3.2; 3 -5.8,2.4; 4 -5.8,1.6; 5 -5.8,0.8; 6 -5.8,0; 7 -5.8,-0.8; 8 -5.8,-1.6; 9 -5.8,-2.4; 10 -5.8,-3.2; 11 -5.8,-4; 23 5.8,-4; 24 5.8,-3.2; 25 5.8,-2.4; 26 5.8,-1.6; 27 5.8,-0.8; 28 5.8,0; 29 5.8,0.8; 30 5.8,1.6; 31 5.8,2.4; 32 5.8,3.2; 33 5.8,4 | smd 0.5 x 1.5: 12 -4,-5.8; 13 -3.2,-5.8; 14 -2.4,-5.8; 15 -1.6,-5.8; 16 -0.8,-5.8; 17 0,-5.8; 18 0.8,-5.8; 19 1.6,-5.8; 20 2.4,-5.8; 21 3.2,-5.8; 22 4,-5.8; 34 4,5.8; 35 3.2,5.8; 36 2.4,5.8; 37 1.6,5.8; 38 0.8,5.8; 39 0,5.8; 40 -0.8,5.8; 41 -1.6,5.8; 42 -2.4,5.8; 43 -3.2,5.8; 44 -4,5.8
USB-B-PTH = drill 0.914 pad 1.676: D+ 0,1.25; D- 1.981,1.25; GND 0,-1.25; VBUS 1.981,-1.25 | drill 2.286: S1 -2.718,-6.02; S2 -2.718,6.02
OS-1838 = drill 0.8 pad 1.016 long: GND 2.7,1.3; OUT 0,1.3; VCC 5.4,1.3
SOT323 = smd 0.7 x 0.9: 1 -0.65,-1; 2 0.65,-1; 3 0,1.1
SOT223 = smd 1.219 x 2.235: 1 -2.311,-3.099; 2 0,-3.099; 3 2.311,-3.099 | smd 3.6 x 2.2: 4 0,3.099
TSSPXX38 = drill 0.8 square: GND 2.5,1; OUT -0.04,1; VS 5.04,1
SC-70-6 = smd 0.5 x 0.35: A1 -1.05,0.65; A2 -1.05,-0.65; GND -1.05,0; VCC 1.05,0; Y1 1.05,0.65; Y2 1.05,-0.65
MIC-9.7MM = drill 0.8 pad 1.676: 1 -2,1.27; 2 -2,-1.27

### Placement (x,y rotation side)
BATTERY  40.07,29.39 0 top
BLUETOOTH  2.24,46.19 0 top
C1  35.66,70.97 180 top
C2  34.29,61.7 270 top
C3  71.3,82.32 270 top
C4  67.61,82.3 270 top
C5  35.51,80.06 0 top
C6  49.3,59.44 90 top
C7  43.94,52.98 0 top
C8  72.77,19.63 0 top
C9  75.51,15.16 90 top
C10  38.33,4.11 0 top
C11  98.03,9.43 270 top
C12  7.67,29.07 180 top
C13  41.63,44.15 270 top
C14  46.28,44.17 270 top
C15  55.85,55.6 0 top
C16  26.44,36.83 0 top
C17  31.37,30.61 270 top
C18  32.79,97.99 0 top
C19  35.18,86.39 180 top
C20  29.97,87.76 180 top
C21  29.18,11.35 90 top
C22  29.13,17.42 270 top
C23  8.38,80.49 90 top
C24  23.32,89.48 0 top
C25  77.88,90.98 180 top
C26  91.87,83.77 270 top
C27  26.9,30.61 270 top
C28  3.66,50.6 0 top
C29  50.39,35.51 0 top
C30  58.27,35.92 180 top
C32  84.1,54.66 180 top
C33  76.17,42.57 180 top
C34  97.89,52.17 270 top
C35  3.35,41.58 0 top
C36  23.06,47.52 180 top
C37  24.77,17.48 90 top
CRYSTAL  69.4,76.8 180 top
D1  56.08,17.19 180 top
D2  18,18 180 top
F1  71.51,14.88 270 top
I2C  2.18,37.98 0 top
IC1  34.02,92.45 90 top
IC2  41.2,14.99 270 top
IC3  91.72,52.2 270 top
J1  75.12,59.13 90 top
L1  45.26,58.75 90 top
L2  16.24,8.29 180 top
LCD(5110)  41,88 0 top
LCD_BTN  94.07,17.81 0 top
LCD_BTN1  93.88,28.3 0 top
LCD_BTN2  93.97,38.94 180 top
LED4  74.98,30.76 90 top
MTRA  50.39,29.39 0 top
MTRB  60.23,29.39 0 top
PWRLED  81,2.88 180 top
Q1  69.36,29.75 0 top
Q2  5.54,17.96 270 top
QTR-3RC  21.69,42.98 0 top
R1  69.44,72.44 180 top
R2  49.38,2.64 180 top
R3  46.25,84.07 180 top
R4  70.08,66.95 270 top
R5  65.28,66.95 270 top
R6  66.12,14.27 0 top
R7  65.76,19.41 0 top
R8  93.19,10.74 0 top
R9  93.27,7.16 180 top
R10  18.26,22.15 0 top
R11  13.44,20.75 270 top
R12  56.52,94.49 270 top
R13  81.03,9.17 90 top
R14  84.1,9.17 270 top
R15  87.17,9.22 270 top
R16  79.86,29.34 90 top
R17  17.5,56.31 180 top
R18  17.5,51.94 0 top
R19  14.5,77.7 0 top
R20  21.95,84.73 90 top
R21  71.42,90.91 90 top
R22  94.92,89.33 0 top
R23  83.21,29.31 90 top
R24  63.77,94.11 180 top
R25  13.97,72.31 90 top
R26  86.44,90.55 0 top
R27  95.73,47.19 0 top
R28  13.65,86.02 0 top
R29  94.77,69.39 180 top
R30  69.27,37.31 0 top
R31  85.06,85.69 270 top
R32  19.81,93.34 270 top
R33  66.57,42.19 0 top
R34  88.34,75.09 0 top
R35  9.17,67.74 0 top
R36  85.14,15.09 180 top
R37  79.96,15.62 90 top
R38  86.28,23.16 90 top
R39  86.87,30.05 90 top
R40  86.39,64.57 90 top
R41  84.07,50.27 0 top
R42  82.98,44.83 90 top
R43  76.17,50.95 180 top
R44  76.23,46.86 180 top
R45  92.94,44.53 0 top
R46  24.77,11.38 90 top
R47  47.19,94.51 270 top
R48  51.77,94.64 270 top
R49  95.89,56.49 180 top
R50  89.74,56.79 0 top
RESET_BUTTON  55.97,6.62 90 top
RXLED  84.08,2.88 180 top
S1  80.65,37.28 90 top
S2  2.29,8.28 180 top
S3  7.26,8.31 180 top
S4  23.59,65.01 180 top
SG1  7.89,59.67 270 top
T1  17.2,62.04 0 top
T2  [SOT-23']  80.16,21.36 0 top
TSALXX  3.81,72.31 90 top
TSALXX1  14.76,94.75 180 top
TSALXX2  86.25,96.25 0 top
TSALXX3  96.14,75.31 270 top
TXLED  87.16,2.88 180 top
U1  53.5,44.12 0 top
U$1  50.44,73.37 90 top
U$2  70.32,8.61 90 top
U$3  92.66,2.24 0 top
U$4  41.41,95.9 180 top
U$5  19.37,31.53 90 top
U$6  97.41,80.39 90 top
U$7  78.9,97.52 180 top
U$8  27.4,95.52 180 top
U$9  2.54,84.47 270 top
U$10  61.99,52.25 90 top
U$13  94.48,62.83 0 top

### Tracks (layer width: path | path; a pad name or v marks a point on that pad's centre or on a via)
2,6
  Top 0.406: 35.05,90.98 35.05,90.07 36.58,88.54 36.58,86.41 C19.1 36.73,86.56 59.28,86.56 60.2,87.48 60.2,88.54 56.54,92.2 56.54,92.96 R12.2 | 35.05,90.98 35.81,91.75 36.58,91.75 IC1.2 | IC1.6 31.55,92.96 32.92,92.96 34.9,90.98 35.05,90.98
38KHZOUT
  Top 0.406: R24.2 63.7,94.18 60.66,97.23 55.47,97.23 51.82,93.57 51.82,93.27 R48.2 51.66,93.57 50.9,94.34 46.02,94.34 44.65,92.96 36.73,92.96 IC1.3
+5V  (via drill 0.51, 0.6)
  Top 0.406: QTR-3RC.2 24.23,43.13 24.38,43.28 24.38,47.4 C36.1 24.54,47.7 34.29,57.45 34.29,57.91 | 34.29,57.91 C2.2 | 26.98,32 C27.1 26.82,31.85 26.52,31.55 | 31.24,32 C17.1 | 22.55,31.55 U$5.2 22.4,31.7 | I2C.1 2.13,38.1 1.98,38.25 1.98,41.45 C35.1 1.98,41.76 1.98,45.87 2.13,46.02 BLUETOOTH.1 2.29,46.33 2.29,50.6 C28.1 2.44,50.44 7.77,55.78 SG1.+ 7.77,55.93 7.77,61.87 6.71,62.94 6.71,64.01 10.52,67.82 R35.2 10.67,67.82 10.67,70.1 12.95,72.39 12.95,76.35 | v40.23,93.88 39.78,94.34 36.73,94.34 IC1.4 | v45.57,80.62 45.57,78.49 44.65,77.57 U$1.34 44.5,77.42 39.62,77.42 37.03,80.01 C5.2 36.88,80.16 36.88,80.62 31.39,86.11 31.39,87.63 C20.1 31.39,87.78 31.39,90.53 IC1.8 | 12.95,76.35 12.95,77.57 R19.1 | v22.86,97.08 21.18,95.4 21.18,93.27 19.96,92.05 R32.2 19.81,85.95 21.95,83.82 R20.1 21.79,83.21 21.79,81.23 16.92,76.35 12.95,76.35 | R2.2 48.01,2.74 48.01,7.32 57.76,17.07 D1.C 57.76,17.37 v57.76,18.9 | R13.2 81.08,10.67 83.97,10.67 R14.1 84.28,10.67 87.17,10.67 R15.1 87.33,10.67 91.75,10.67 R8.1 | R9.1 94.64,7.16 94.64,7.62 91.75,10.52 R8.1 | S1.2 80.77,37.34 83.06,37.34 S1.3 83.36,37.19 83.36,32.92 85.5,30.79 85.5,30.33 85.88,29.95 | LCD_BTN.1 90.22,20.12 97.99,20.12 LCD_BTN.2 | 97.84,33.68 97.84,36.58 LCD_BTN2.1 97.99,36.88 99.21,38.1 99.21,47.4 97.99,48.62 97.69,48.62 96.47,49.84 96.47,53.65 | 97.84,33.68 97.84,30.63 LCD_BTN1.2 97.99,30.48 99.06,29.41 99.06,25.15 97.99,24.08 97.99,20.27 LCD_BTN.2 | 89.92,33.68 89.92,36.58 LCD_BTN2.2 | 89.92,33.68 89.92,30.63 LCD_BTN1.1 89.76,30.48 89.46,30.18 86.11,30.18 85.88,29.95 | 85.88,29.95 83.97,28.04 83.36,28.04 R23.1 83.21,28.04 79.86,28.04 R16.1 79.86,27.74 79.25,27.13 79.25,22.4 T2.2
  Top 0.406: 89.92,33.68 97.84,33.68 | R8.1 91.9,10.82 92.35,10.82 96.01,14.48 99.06,14.48 99.36,14.78 99.36,18.75 98.15,19.96 LCD_BTN.2 | 62.48,65.68 65.23,65.68 R5.2 65.38,65.68 69.95,65.68 R4.2 | 62.48,65.68 61.57,65.68 60.5,66.75 60.5,70.87 56.39,70.87 U$1.14 | v45.26,61.57 45.26,59.89 L1.2 | v47.4,63.7 47.4,66.6 47.24,66.75 47.24,67.51 U$1.2 | 52.58,47.85 U1.20 | 53.03,47.85 U1.19 52.66,47.78 52.58,47.85 | 61.42,54.25 62.03,53.65 62.03,53.34 U$10.VCC 61.99,52.77 61.82,52.6 59.92,52.6 59.79,52.73 54.91,52.73 54.25,52.07 54.25,50.88 52.53,49.15 52.53,47.9 52.58,47.85 | 61.42,54.25 55.78,54.25 54.56,55.47 C15.1 54.41,55.78 v53.03,57.15 | 62.48,55.47 62.48,65.68 | 62.48,55.47 61.42,54.41 61.42,54.25 | 93.42,89.31 R22.1 | R26.2 87.94,90.53 92.05,90.53 93.27,89.31 R22.1 | 71.48,89.61 R21.1 71.63,89.61 73.15,89.61 84.43,78.33 84.43,68.12 86.41,66.14 R40.2 | v41.6,57.91 34.29,57.91 | v65.58,52.86 65.1,52.86 62.48,55.47 | R40.2 86.41,65.99 89.92,65.99 93.27,69.34 R29.2 93.42,69.49 93.42,75.59 95.56,77.72 95.86,77.72 97.54,79.4 97.54,90.53 97.38,90.68 95.1,90.68 93.73,89.31 R22.1 | 96.47,53.65 94.79,53.65 94.34,54.1 IC3.8 | 96.47,53.65 97.84,53.65 C34.1 97.84,53.8 98.6,54.56 98.6,57.45 98.15,57.91 96.32,57.91 94.94,56.54 94.49,56.54 R49.2 | 74.68,55.17 74.68,55.78 73.91,56.54 J1.2 | 74.68,55.17 74.68,51.05 R43.2 | 74.68,55.17 77.42,55.17 81.69,59.44 81.69,60.81 86.26,65.38 86.26,65.84 R40.2
  Top 1.016: 31.24,32 26.98,32 | 26.52,31.55 22.55,31.55 | v18.14,31.7 22.4,31.7
  Bottom 0.406: 2.29,37.95 I2C.1 | QTR-3RC.2 24.08,43.13 23.47,43.13 10.82,55.78 7.92,55.78 SG1.+ | v45.57,80.62 46.02,81.08 46.02,87.94 LCD(5110).3 46.02,88.09 v40.23,93.88 35.97,93.88 32.77,97.08 v22.86,97.08 | v57.76,18.9 62.33,18.9 80.62,37.19 S1.2 80.62,37.49 80.62,38.25 68.12,50.75 68.12,50.9 | 68.12,50.9 73.76,56.54 J1.2 | v41.6,57.91 v45.26,61.57 v47.4,63.7 54.41,63.7 54.41,57.3 53.03,57.3 v53.03,57.15 | 68.12,50.9 67.54,50.9 v65.58,52.86
  Bottom 1.016: v18.14,31.7 8.53,31.7 2.29,37.95
A0  (via drill 0.51)
  Top 0.406: v41.3,74.37 42.37,75.44 43.13,75.44 43.43,75.74 44.5,75.74 U$1.36 | v32.61,71.02 31.39,69.8 v31.39,61.27
  Bottom 0.406: v41.3,74.37 35.97,74.37 v32.61,71.02 | v31.39,61.27 31.39,47.7 26.82,43.13 QTR-3RC.3
A1  (via drill 0.51)
  Top 0.406: v42.52,74.22 43.13,74.83 44.5,74.83 U$1.37 | v32.77,64.31 v32.77,69.8
  Bottom 0.406: v42.52,74.22 38.1,69.8 v32.77,69.8 | v32.77,64.31 32.77,46.48 29.41,43.13 QTR-3RC.4
A01
  Top 0.406: 49.94,38.63 49.94,40.45 U1.1 U1.2
  Top 1.016: MTRA.2 52.89,26.6 50.29,24 47.55,24 45.19,26.36 45.19,31.7 C29.1 48.99,37.69 49.94,38.63 50.27,38.96 50.27,40.66
A2  (via drill 0.51)
  Top 0.406: v47.4,73.15 46.48,74.07 44.65,74.07 U$1.38 | v43.13,69.19 43.13,54.71 43.89,53.95 43.89,51.97 38.1,46.18 34.9,46.18 31.85,43.13 QTR-3RC.5
  Bottom 0.406: v47.4,73.15 47.4,72.85 43.74,69.19 v43.13,69.19
A02
  Top 0.406: 52.53,38.91 U1.5 U1.6
  Top 1.016: MTRA.1 47.89,29.27 51.74,33.12 51.74,35.45 C29.2 51.79,38.18 52.53,38.91 52.86,39.24 52.86,40.66
A3  (via drill 0.51)
  Top 0.406: v46.18,73 45.87,73.3 44.65,73.3 U$1.39 | v37.8,66.75 v40.23,69.19 | v26.82,69.8 v29.87,66.75
  Bottom 0.406: v46.18,73 44.04,73 v40.23,69.19 | v29.87,66.75 v37.8,66.75 | v26.82,69.8 25.15,69.8 23.77,71.17 13.56,71.17 12.5,72.24 12.5,75.59 3.66,84.43 U$9.OUT
A4
  Top 0.406: U$1.40 44.5,72.69 41.6,72.69 35.36,78.94 35.36,81.23 29.87,86.72 29.87,92.2 27.58,94.49 U$8.OUT
A5  (via drill 0.51)
  Top 0.406: v50.9,75.74 50.9,75.29 47.4,71.78 44.65,71.78 U$1.41 | v65.84,81.53 v60.05,75.74
  Bottom 0.406: v60.05,75.74 v50.9,75.74 | v65.84,81.53 65.84,83.52 78.79,96.47 U$7.OUT
AIN2
  Top 0.406: U$10.Y1 61.27,53.34 53.65,53.34 53.47,53.16 53.47,50.95 52.02,49.51 51.44,49.51 51.21,49.28 51.21,47.85 U1.22
B01
  Top 0.406: U1.12 | 57.07,38.86 U1.12 | U1.12 U1.11
  Top 1.016: MTRB.2 62.69,28.16 62.69,32.82 59.67,35.84 C30.1 59.67,36.27 57.07,38.86 56.74,39.19 56.74,40.66
B02
  Top 0.406: 54.48,38.66 U1.8 U1.7
  Top 1.016: MTRB.1 57.73,33.13 56.87,33.98 C30.2 56.87,36.27 54.48,38.66 54.15,38.99 54.15,40.66
BIN2  (via drill 0.6)
  Top 0.406: U$10.Y2 62.64,52.5 62.08,51.94 60.81,51.94 60.02,51.16 59.99,51.16 v58.88,50.04 | v57.33,51.66 56.97,51.31 56.97,50.95 55.12,49.1 U1.16
  Bottom 0.406: v58.88,50.04 58.88,50.11 v57.33,51.66
CTRL
  Top 0.406: C18.1 31.39,94.49 IC1.5
D4  (via drill 0.51)
  Top 0.406: v52.73,77.57 52.73,79.1 U$1.25 | R9.2 91.9,7.16 91.9,4.42 92.66,3.66 U$3.OUT
  Bottom 0.406: v52.73,77.57 77.27,77.57 82.3,72.54 85.65,72.54 90.98,67.21 90.98,5.33 92.66,3.66 U$3.OUT
D5  (via drill 0.51)
  Top 0.406: v46.18,76.5 48.01,78.33 48.01,79.1 U$1.31 | v30.79,70.56 30.79,66.29 v22.86,58.37 | v18.14,58.06 18.14,57.15 18.9,56.39 R17.1
  Bottom 0.406: v46.18,76.5 44.2,76.5 42.98,75.29 35.51,75.29 v30.79,70.56 | v22.86,58.37 18.44,58.37 v18.14,58.06
D6  (via drill 0.51)
  Top 0.406: v58.98,51.82 55.78,48.62 55.78,47.85 U1.15 | v68.58,58.37 68.58,60.81 72.69,64.92 72.69,81.84 72.08,82.45 53.49,82.45 51.36,80.31 51.36,79.25 U$1.27
  Bottom 0.406: v58.98,51.82 62.03,51.82 v68.58,58.37
D7  (via drill 0.6)
  Top 0.406: U$10.A1 61.27,51.05 61.27,50.44 60.91,50.09 60.91,47.8 59.69,46.58 59.69,46.56 59.18,46.56 v57.68,45.06 57.68,44.55 56.24,43.1 51.71,43.1 51.51,43.31 49.51,43.31 49.1,43.71 49.1,45.85 47.8,47.14 47.62,47.14 47.09,47.68 47.09,62.64 46.48,63.25 46.48,67.51 U$1.1 | U1.21 51.87,47.77 51.87,46.79 51.84,46.76 51.84,46.33 52.15,46.02 52.15,45.52 52.81,44.86 54.38,44.86 v54.81,45.29
  Bottom 0.406: v54.81,45.29 55.45,45.92 56.87,45.92 56.87,45.87 v57.68,45.06
D8  (via drill 0.51, 0.6)
  Top 0.406: v63.7,71.63 64.92,70.41 65.53,70.41 68.89,67.06 70.87,67.06 71.48,66.45 71.48,64.62 67.67,60.81 67.67,51.84 v63.91,48.08 62.79,49.2 62.79,51.05 U$10.A2 | v51.36,77.42 50.44,78.33 50.44,79.1 U$1.28 | 54.48,48.63 U1.17 54.48,50.04 v55.45,51
  Bottom 0.406: v63.7,71.63 60.96,74.37 60.96,76.2 60.5,76.66 52.12,76.66 v51.36,77.42 | v63.91,48.08 58.34,48.08 55.45,50.98 v55.45,51
D9  (via drill 0.51)
  Top 0.406: v49.68,77.57 49.68,79.1 U$1.29 | v92.51,59.74 89,59.74 87.02,57.76 87.02,55.78 88.01,54.79 | 88.01,54.79 88.7,54.1 IC3.1 | 88.01,54.79 86.56,53.34 86.26,53.34 84.12,51.21 84.12,49.38 83.06,48.31 83.06,46.33 R42.2
  Bottom 0.406: v49.68,77.57 50.14,77.57 51.97,79.4 79.7,79.4 93.88,65.23 93.88,61.11 v92.51,59.74
D10  (via drill 0.51)
  Top 0.406: v79.25,63.09 79.25,80.77 74.07,85.95 54.71,85.95 48.92,80.16 48.92,79.25 U$1.30 | v86.11,26.21 85.65,26.21 83.82,24.38 83.82,15.09 R36.2 83.67,14.94 83.06,14.33 80.01,14.33 R37.1
  Bottom 0.406: v79.25,63.09 79.25,62.64 86.11,55.78 v86.11,26.21
D11  (via drill 0.6)
  Top 0.406: U$1.12 59.13,69.37 59.13,61.8 55.09,61.8 v53.16,59.87 | U1.23 50.57,54.2 v50.67,54.3
  Bottom 0.406: v50.67,54.3 50.67,55.88 52.02,57.23 52.02,58.09 53.16,59.23 v53.16,59.87
D12  (via drill 0.51)
  Top 0.406: v64.47,81.53 64.16,81.84 53.8,81.84 52.12,80.16 52.12,79.25 U$1.26
  Bottom 0.406: v64.47,81.53 65.99,80.01 96.01,80.01 96.32,80.31 U$6.OUT
D+  (via drill 0.51)
  Top 0.406: v46.18,54.71 46.18,62.03 45.72,62.48 45.72,68.58 45.87,68.73 48.46,68.73 48.77,68.43 48.77,67.67 U$1.4 | v62.94,20.88 64.31,19.51 R7.1
  Bottom 0.406: v46.18,54.71 46.18,42.52 61.42,27.28 61.42,22.4 v62.94,20.88
D-  (via drill 0.51)
  Top 0.406: v48.01,62.33 48.31,62.64 48.31,64.16 48.16,64.31 48.16,67.51 U$1.3 | v61.11,28.96 61.11,19.05 64.62,15.54 64.62,14.33 R6.1
  Bottom 0.406: v48.01,62.33 48.01,49.68 49.38,48.31 49.73,48.31 51.31,46.74 51.31,43.13 52.88,41.55 52.88,37.19 v61.11,28.96
DRAIN  (via drill 0.51)
  Top 0.406: R25.2 14.02,72.24 15.09,72.24 19.66,67.67 23.47,67.67 S4.3 | R31.2 85.19,85.65 85.19,78.18 88.24,75.13 R34.2 88.09,74.98 88.09,74.22 v85.34,71.48
  Bottom 0.406: R28.2 13.72,85.95 13.72,84.89 14.78,83.82 14.78,73.15 14.02,72.39 R25.2 | v85.34,71.48 80.77,71.48 80.62,71.63 67.06,71.63 63.55,68.12 44.81,68.12 44.35,67.67 23.62,67.67 S4.3
GND  (via drill 0.51, 0.6)
  Top 0.406: 52.88,71.63 49.68,68.43 49.68,67.67 U$1.5 | 52.88,71.63 56.24,71.63 U$1.15 | 52.88,71.63 52.88,74.83 54.41,76.35 54.41,79.1 U$1.23 54.41,79.25 v54.41,80.92 | C3.1 71.17,83.82 67.67,83.82 C4.1 67.51,83.97 v60.35,83.97 | IC1.1 36.73,90.53 38.56,90.53 41,88.09 LCD(5110).1 | v32.31,96.16 34.14,97.99 C18.2 | R47.1 47.09,96.01 41.45,96.01 41.3,96.16 41.3,96.32 40.84,96.77 U$4.2 40.84,97.08 42.82,99.06 73.91,99.06 76.35,96.62 U$7.GND 76.5,96.47 76.5,92.35 | 76.5,92.35 80.31,92.35 84.43,88.24 86.72,88.24 90.53,84.43 90.53,83.67 91.75,82.45 C26.2 92.05,82.45 92.35,82.75 96.32,82.75 U$6.GND | QTR-3RC.1 21.64,43.13 21.64,47.4 C36.2 21.64,47.7 21.64,49.23 19.05,51.82 R18.2 | 20.12,57.45 18.29,59.28 18.29,60.81 T1.E | 20.12,57.45 20.12,53.03 19.05,51.97 R18.2 | R18.2 18.75,51.82 17.53,50.6 C28.2 5.03,50.6 5.03,46.48 4.88,46.33 BLUETOOTH.2 4.88,46.02 4.88,41.76 C35.2 4.72,41.45 4.72,38.1 I2C.2 4.72,37.8 4.72,33.71 1.85,30.84 1.35,30.84 0.71,30.2 0.71,27.03 3.05,24.69 3.05,23.95 | 36.88,69.65 35.51,69.65 34.29,70.87 C1.2 34.29,71.17 34.29,80.01 C5.1 33.98,80.16 28.65,85.5 28.65,87.63 C20.2 28.65,87.94 v28.65,92.05 | 36.88,69.65 38.1,69.65 38.56,70.1 44.5,70.1 U$1.43 | 36.88,63.09 C2.1 34.44,62.94 28.96,57.45 20.12,57.45 | 36.88,63.09 37.8,63.09 42.52,58.37 42.52,53.03 C7.1 | 36.88,63.09 36.88,69.65 | 70.41,27.74 70.41,23.32 74.07,19.66 C8.2 74.22,19.51 75.44,18.29 75.44,16.61 C9.2 75.59,17.07 76.96,17.07 | 70.41,27.74 70.41,28.5 Q1.2 | 76.96,17.07 79.86,17.07 R37.2 | RESET_BUTTON.4 58.37,10.52 58.37,2.9 RESET_BUTTON.3 58.37,2.74 61.11,2.74 64.16,5.79 U$2.S2 64.47,5.94 68.89,5.94 71.48,8.53 U$2.GND 71.63,8.53 73.61,8.53
  Top 0.406: C11.1 98.15,10.82 98.15,10.21 99.36,8.99 99.36,2.44 98.6,1.68 97.23,1.68 95.4,3.5 U$3.GND 95.25,3.5 94.94,3.5 92.2,0.76 81.99,0.76 81.08,1.68 PWRLED.C 80.92,1.98 80.16,1.98 76.35,5.79 U$2.S1 76.2,5.94 73.61,8.53 | 76.96,17.07 76.96,12.04 73.61,8.69 73.61,8.53 | 52.12,58.06 54.71,58.06 57.15,55.63 C15.2 | 52.12,58.06 49.38,58.06 C6.1 | U1.18 53.8,47.7 53.8,46.43 v53.34,45.97 | v52.12,50.9 52.12,58.06 | 74.83,43.59 74.83,46.79 R44.2 74.68,46.94 72.39,49.23 72.39,59.59 73.76,60.96 73.76,61.57 J1.6 | 74.83,43.59 74.83,42.67 C33.2 74.98,42.67 76.5,41.15 83.97,41.15 87.48,44.65 91.29,44.65 R45.1 91.44,44.65 91.44,48.01 89.53,49.91 | 62.03,45.26 62.03,51.05 U$10.GND | 62.03,45.26 65.08,42.22 R33.1 | 74.83,43.59 66.75,43.59 65.38,42.22 R33.1 | 62.03,45.26 59.59,45.26 56.69,42.37 55.93,42.37 55.58,42.04 55.58,40.66 | 29.26,12.8 C21.2 | 29.26,16 C22.2 | 16.15,31.39 U$5.4 16.46,31.55 16.92,31.55 | 26.98,29.26 C27.2 26.82,29.26 | 31.24,29.26 C17.2 31.39,29.41 | 27.89,36.73 C16.2 | 22.55,29.26 U$5.1 22.4,29.26 | v26.82,16.76 24.84,18.75 24.84,18.9 C37.2 | 42.52,28.19 BATTERY.2 42.37,28.19 | 39.93,30.94 39.93,30.79 | 70.41,27.74 67.82,27.74 65.38,30.18 65.38,42.06 R33.1 | 41.05,36.73 41.45,36.32 | U1.3 U1.4 51.88,41.83 51.69,42.01 | 55.58,40.66 U1.10 | 55.58,40.66 55.33,40.66 U1.9 | 76.5,92.35 76.5,90.98 C25.2 | C19.2 33.83,86.26 34.29,86.26 36.42,84.12 v42.67,84.12 44.81,84.12 R3.2 | U$9.GND 3.66,81.99 8.38,81.99 C23.2 8.38,82.14 12.5,86.26 12.5,86.41 13.56,87.48 14.02,87.48 14.78,88.24 14.78,95.1 17.68,97.99 23.32,97.99 24.84,96.47 24.84,94.64 U$8.GND 24.84,94.49 24.84,89.61 C24.2
  Top 0.406: v42.82,76.5 44.5,76.5 U$1.35 | 35.36,15.09 IC2.3 | 43.74,15.09 IC2.6 | 89.53,49.91 89.15,50.29 IC3.4 | 89.53,49.91 90.68,51.05 90.68,54.56 90.37,54.86 90.22,54.86 88.39,56.69 R50.1 88.54,56.69 90.68,58.83 93.12,58.83 95.63,61.34 | 95.63,61.34 92.96,64.01 92.51,64.01 U$13.1 | 95.63,61.34 99.21,57.76 99.21,52.58 97.99,51.36 97.99,50.9 C34.2
  Top 0.61: 2.69,17.02 4.28,17.02 Q2.3
  Top 1.016: 29.26,16 29.26,15.09 | 29.26,15.09 29.26,12.8 | 15.16,31.39 14.33,31.39 12.04,29.11 C12.- 11.73,29.11 11.23,29.11 6.07,23.95 3.05,23.95 | 15.16,31.39 16.15,31.39 | 31.24,29.26 26.98,29.26 | 26.82,29.26 22.55,29.26 | 22.4,29.26 17.3,29.26 15.16,31.39 | 42.52,28.19 39.93,30.79 | v3.05,22 3.05,23.95 | v10.46,20.9 10.46,19.76 13.03,19.76 R11.2 | C21.2 28.68,12.75 v26.82,10.9 | 31.39,29.41 32.89,29.41 34.27,30.79 39.78,30.79 39.93,30.94 41.45,32.46 41.45,36.32 41.45,42.67 41.56,42.67 C13.2 46.25,42.74 C14.2 48.03,42.77 48.77,42.04 51.54,42.04 | 27.89,36.73 41.05,36.73 | 51.54,42.04 51.66,42.04 | 51.66,42.04 51.69,42.01 | 51.54,40.26 51.54,42.04 | 51.66,42.04 v54.2,42.04 55.58,42.04 55.47,41.94 55.47,40.28 | 3.05,23.95 1.09,22 1.09,18.62 2.69,17.02 | 29.26,15.09 35.36,15.09 | 43.74,15.09 35.51,15.09 IC2.3 | v29.59,5.59 34.46,5.59 C10.-
  Bottom 0.406: 28.65,96.16 26.52,96.16 24.99,94.64 U$8.GND | 28.65,96.16 v32.31,96.16 32.46,96.16 40.54,88.09 40.84,88.09 LCD(5110).1 41.15,87.94 42.82,86.26 42.82,84.12 | v52.12,50.9 52.12,46.61 52.76,45.97 v53.34,45.97 | 42.52,28.04 BATTERY.2 | 42.82,84.12 42.82,79.7 | 42.82,79.7 v42.82,76.5 | v42.67,84.12 42.82,84.12 | 51.51,83.82 48.31,80.62 46.94,80.62 46.02,79.7 42.82,79.7 | 51.51,83.82 55.63,87.94 56.08,87.94 LCD(5110).7 56.39,87.94 v60.35,83.97 63.4,83.97 75.89,96.47 76.35,96.47 U$7.GND | 51.51,83.82 v54.41,80.92 | 28.65,96.16 v28.65,92.05
  Bottom 1.016: 28.04,12.12 28.04,7.14 v29.59,5.59 | 42.52,28.04 29.03,14.55 | 29.03,14.55 28.04,13.56 28.04,12.12 | 29.03,14.55 v26.82,16.76 | v3.05,22 3.05,20.85 10.41,20.85 v10.46,20.9 | 28.04,12.12 v26.82,10.9 | v54.2,42.04 54.2,43.48 53.31,44.37 53.31,45.95 v53.34,45.97
  pour Top (isolate 0.305): 0,0 100,0 100,100 0,100
  pour Bottom (isolate 0.305): 0,0 100,0 100,100 0,100
MISO  (via drill 0.51, 0.6)
  Top 0.406: v69.49,60.2 69.49,54.86 v71.48,52.88 | v61.72,85.04 74.07,85.04 78.33,80.77 78.33,61.11 79.1,60.35 79.1,59.28 76.5,56.69 J1.1 | U$1.11 57.35,67.57 v57.35,63.63
  Bottom 0.406: v69.49,60.2 69.14,60.55 60.4,60.55 57.35,63.6 v57.35,63.63 | v71.48,52.88 72.69,52.88 76.35,56.54 J1.1 | v61.72,85.04 58.83,87.94 LCD(5110).8
MOSI  (via drill 0.51, 0.6)
  Top 0.406: U$1.10 53.65,67.51 53.65,66.42 54.23,65.84 55.83,65.84 v55.83,63.48 | v76.81,80.92 76.81,67.06 v72.39,62.64
  Bottom 0.406: 72.39,59.28 73.76,59.28 J1.4 | v76.81,80.92 80.16,84.28 80.16,97.38 79.86,97.69 61.42,97.69 51.82,88.09 51.21,88.09 LCD(5110).5 | 72.39,59.28 v72.39,62.64 | v55.83,63.48 60.02,59.28 72.39,59.28
N$1
  Top 0.406: C7.2 45.26,53.03 45.26,57.61 L1.1 45.11,57.76 44.35,58.52 44.35,62.03 44.5,62.18 44.5,69.34 U$1.44 44.81,69.49 46.02,69.49 53.65,77.11 53.65,79.1 U$1.24
N$2
  Top 0.406: U$1.42 44.5,71.02 37.19,71.02 C1.1
N$3
  Top 0.406: U$1.6 50.44,67.51 50.44,62.03 49.38,60.96 C6.2
N$4
  Top 0.406: C4.2 67.67,80.77 67.67,80.01 69.04,78.64 69.04,77.11 67.67,75.74 CRYSTAL.3 67.36,75.59 67.36,73.3 R1.2 67.97,72.54 67.21,73.3 56.39,73.3 U$1.17
N$5
  Top 0.406: C3.2 71.32,80.77 71.32,78.03 CRYSTAL.1 71.17,77.88 69.8,76.5 69.8,73.3 70.56,72.54 R1.1 70.71,72.39 69.34,71.02 67.06,71.02 65.53,72.54 56.39,72.54 U$1.16
N$6
  Top 0.406: F1.2 71.63,13.72 71.63,10.67 U$2.VBUS
N$7
  Top 0.406: U$1.33 46.48,79.25 46.48,82.91 47.55,83.97 R3.1
N$8
  Top 0.406: LCD_BTN2.3 97.84,41.3 90.07,41.3 LCD_BTN2.4 89.92,41.15 86.87,38.1 R39.2
N$9
  Top 0.406: R6.2 67.67,14.17 67.67,12.04 69.04,10.67 U$2.D-
N$10
  Top 0.406: R7.2 67.06,19.36 67.06,16.15 66.29,15.39 66.29,11.43 69.04,8.69 U$2.D+
N$11
  Top 0.406: R45.2 94.34,44.65 94.34,47.09 R27.1 94.34,47.4 94.34,50.29 IC3.5
N$12
  Top 0.406: U$3.VCC 98.15,3.66 98.15,7.92 C11.2 97.84,8.08 95.25,10.67 94.64,10.67 R8.2
N$14
  Top 0.406: PWRLED.A 81.08,3.96 81.08,7.62 R13.1
N$15
  Top 0.406: R10.1 17.07,22.25 18.29,23.47 20.73,23.47 22.25,21.95 27.28,21.95 27.58,22.25 33.83,22.25 37.03,19.05 37.03,17.68 36.12,16.76 35.51,16.76 IC2.2
  Top 0.61: R11.1 R10.1
N$16
  Top 0.406: U$4.1 42.22,96.93 45.87,96.93 46.18,97.23 50.6,97.23 51.66,96.16 R48.1
N$17
  Top 0.406: LCD_BTN.4 97.99,15.7 90.22,15.7 LCD_BTN.3 90.07,15.54 87.02,15.54 86.56,15.09 R36.1 87.02,15.7 86.41,16.31 86.41,21.64 R38.1
N$18
  Top 0.406: 87.63,25.91 89.76,25.91 LCD_BTN1.3 90.07,26.06 LCD_BTN1.4 | 87.63,25.91 86.41,24.69 R38.2 | R39.1 86.87,26.82 87.63,26.06 87.63,25.91
N$19
  Top 0.406: 85.65,61.57 85.65,62.48 86.26,63.09 R40.1 | 85.65,61.57 85.65,54.71 C32.1 | 85.65,61.57 92.35,61.57 U$13.2
N$20
  Top 0.406: R41.1 82.75,50.29 82.75,54.56 C32.2
N$21
  Top 0.406: R42.1 83.06,43.43 83.06,43.89 85.34,46.18 85.34,50.14 R41.2 85.65,50.29 88.09,52.73 89,52.73 IC3.2
N$22
  Top 0.406: RXLED.A 84.12,3.96 84.12,7.62 R14.2
N$23
  Top 0.406: R15.2 87.17,3.96 TXLED.A
N$24
  Top 0.406: 79.86,30.79 76.05,30.79 LED4.A | 80.01,30.79 83.21,30.79 R23.2 | 79.86,30.79 R16.2 80.01,30.79 | 80.01,30.79 79.86,30.79
N$25
  Top 0.406: T1.B 16.15,60.81 16.15,56.39 R17.2 16.15,56.24 16.15,51.97 R18.1
N$26
  Top 0.406: 91.29,55.17 91.29,53.8 93.42,51.66 94.18,51.66 IC3.6 | 91.29,55.17 91.29,56.69 R50.2 | 91.29,55.17 95.56,55.17 96.77,56.39 97.23,56.39 R49.1
N$27
  Top 0.406: T1.C 17.07,63.25 8.08,63.25 7.92,63.4 SG1.-
N$28  (via drill 0.51)
  Top 0.406: v81.23,26.52 81.23,22.4 T2.3 | v84.28,35.05 84.28,36.42 88.7,40.84 88.7,41.91 89.92,43.13 95.25,43.13 95.86,43.74 95.86,52.12 95.25,52.73 94.34,52.73 IC3.7
  Bottom 0.406: v81.23,26.52 81.23,32 v84.28,35.05
N$29
  Top 0.406: R12.1 56.54,95.86 59.44,95.86 63.7,91.59 R24.3
N$30
  pour Top: 0,0 100,0 100,100 0,100
N$31
  Top 0.406: U$4.3 41.3,94.94 39.62,94.94 35.2,99.36 30.18,99.36 26.21,95.4 26.21,71.48 24.99,70.26 24.99,66.45 23.62,65.08 S4.2 23.62,64.92 23.62,62.48 S4.1
N$32  (via drill 3.2)
  other vias: 25,24.5
N$33
  Top 0.406: R25.3 11.43,72.39 4.88,72.39 3.81,73.46 TSALXX.K
N$34
  Top 0.406: R35.1 7.62,67.82 7.01,67.82 3.81,71.02 TSALXX.A
N$35
  Top 0.406: Q1.3 69.49,30.79 73.91,30.79 LED4.C
N$36  (via drill 3.2)
  other vias: 75,24.5
N$37
  Top 0.406: R28.3 13.56,88.7 13.56,94.64 TSALXX1.K
N$38
  Top 0.406: R32.1 19.81,94.79 16.15,94.79 TSALXX1.A
N$39
  Top 0.406: R30.2 70.71,37.34 78.03,37.34 S1.1
N$40
  Top 0.406: Q1.1 68.28,28.65 68.28,36.88 67.97,37.19 R30.1 67.97,37.49 67.97,42.06 R33.2
N$41
  Bottom 0.406: R31.3 87.63,85.8 87.63,96.16 TSALXX2.K
N$42
  Top 0.406: R26.1 85.04,90.68 85.04,96.16 TSALXX2.A
N$43  (via drill 3.2)
  other vias: 7,95
N$44  (via drill 3.2)
  other vias: 93,95
N$45
  Bottom 0.406: R34.3 88.39,77.57 92.51,77.57 96.01,74.07 TSALXX3.K
N$46
  Top 0.406: R29.1 96.16,69.49 96.16,72.39 94.94,73.61 94.94,75.44 96.01,76.5 TSALXX3.A
N$49
  Top 0.61: Q2.1 Q2.2 Q2.5 Q2.6
  Top 1.016: Q2.6 6.79,21.8 11.02,26.04 20.83,26.04 22.2,27.41 36.86,27.41 BATTERY.1
N$50
  Top 0.406: R43.1 77.57,50.9 77.57,46.94 R44.1 77.57,46.79 77.57,42.67 C33.1 77.72,42.52 78.03,42.22 84.12,42.22 86.72,44.81 86.72,49.99 88.24,51.51 89,51.51 IC3.3
N$51
  Top 0.61: 6.78,15.7 Q2.4
  Top 1.016: S2.3 2.29,11.2 6.78,15.7
N$52
  Top 0.406: R46.1 24.84,10.06 24.84,10.52 27.74,13.41 27.74,16.92 28.35,17.53 33.98,17.53 34.75,18.29 35.36,18.29 IC2.1
N$53
  Top 0.406: R46.2 24.84,12.8 24.84,16 C37.1
N$54
  Top 1.016: S2.1 S2.2 7.24,8.28 S3.2
N$55
  Top 0.406: R47.2 47.09,92.96 47.09,91.59 43.59,88.09 LCD(5110).2
RESET  (via drill 0.51)
  Top 0.406: R2.1 50.9,2.74 53.65,2.74 RESET_BUTTON.1 53.65,2.9 53.65,10.52 RESET_BUTTON.2 53.8,10.67 58.98,15.85 58.98,17.98 | 58.98,17.98 58.98,19.05 58.22,19.81 57.3,19.81 54.71,17.22 54.41,17.22 D1.A | v61.57,64.01 59.89,65.68 59.89,70.1 56.39,70.1 U$1.13 | v60.81,17.98 58.98,17.98 | v78.18,59.89 76.5,61.57 J1.5
  Bottom 0.406: v61.57,64.01 74.07,64.01 76.35,61.72 J1.5 | v60.81,17.98 63.55,17.98 81.38,35.81 83.67,35.81 84.58,36.73 84.58,53.49 v78.18,59.89
RX  (via drill 0.51)
  Top 0.406: v57.45,80.31 58.37,79.4 58.37,77.11 57.15,75.89 56.39,75.89 U$1.20 | v39.62,78.79 v43.74,78.79
  Bottom 0.406: v57.45,80.31 57,80.31 56.69,80.01 47.24,80.01 46.02,78.79 v43.74,78.79 | v39.62,78.79 22.4,78.79 14.02,87.17 4.12,87.17 2.29,85.34 2.29,51.36 7.32,46.33 BLUETOOTH.3
RXLED  (via drill 0.51)
  Top 0.406: v85.19,6.25 85.19,3.05 84.12,1.98 RXLED.C | v52.27,65.38 52.27,66.45 52.12,66.6 52.12,67.51 U$1.8 | v80.16,70.71 80.16,80.77 74.37,86.56 67.21,86.56 59.44,94.34 55.47,94.34 53.8,92.66 53.8,88.09 LCD(5110).6
  Bottom 0.406: v85.19,6.25 85.19,55.78 75.21,65.76 | 75.21,65.76 75.13,65.84 52.73,65.84 v52.27,65.38 | 75.21,65.76 v80.16,70.71
SCK  (via drill 0.51)
  Top 0.406: v54.1,64.92 52.88,66.14 52.88,67.51 U$1.9 | v58.83,98.15 60.81,98.15 63.7,95.25 64.16,95.25 70.1,89.31 70.1,88.54 71.48,87.17 74.68,87.17 81.08,80.77 81.08,60.66 v80.01,59.59
  Bottom 0.406: v54.1,64.92 75.13,64.92 77.88,62.18 77.88,60.96 | 77.88,60.96 76.5,59.59 76.5,59.28 J1.3 | v58.83,98.15 48.77,88.09 LCD(5110).4 | v80.01,59.59 78.64,60.96 77.88,60.96
SCL  (via drill 0.51)
  Top 0.406: v62.48,74.22 62.18,73.91 58.67,73.91 58.52,74.07 56.39,74.07 U$1.18 56.08,74.07 55.32,74.07 v54.71,73.46 | v65.38,71.32 65.84,71.32 68.73,68.43 69.95,68.43 R4.1
  Bottom 0.406: v65.38,71.32 v62.48,74.22 | v54.71,73.46 49.23,73.46 44.04,68.28 24.84,68.28 24.08,69.04 19.36,69.04 6.71,56.39 6.71,55.32 11.28,50.75 11.28,45.57 7.32,41.6 7.32,38.1 I2C.3
SDA  (via drill 0.51)
  Top 0.406: v59.13,74.83 56.39,74.83 U$1.19 | R5.1 65.23,68.43 64.01,69.65 v64.01,69.95 63.86,69.65 v61.42,67.21
  Bottom 0.406: v64.01,69.95 v59.13,74.83 | v61.42,67.21 49.53,67.21 40.69,58.37 40.69,49.84 28.96,38.1 9.91,38.1 I2C.4
TX  (via drill 0.51)
  Top 0.406: v53.8,74.37 55.02,75.59 55.02,76.2 55.32,76.5 56.24,76.5 U$1.21
  Bottom 0.406: v53.8,74.37 44.04,74.37 38.56,68.89 25.15,68.89 24.38,69.65 19.05,69.65 6.1,56.69 6.1,49.99 9.75,46.33 BLUETOOTH.4
TXLED  (via drill 0.51)
  Top 0.406: v88.24,6.25 88.24,3.05 87.17,1.98 TXLED.C | v81.99,74.22 v81.99,70.56 | v57.45,78.49 56.39,77.42 U$1.22
  Bottom 0.406: v88.24,6.25 88.24,64.31 v81.99,70.56 | v81.99,74.22 81.53,74.22 77.27,78.49 v57.45,78.49
V_BATT  (via drill 0.51, 0.6)
  Top 0.406: 29.11,18.9 C22.1 | 20.27,22.1 19.81,22.1 R10.2 | 41.76,45.57 C13.1 | 24.99,36.42 24.99,36.73 C16.1 25.15,36.88 | 3.5,29.11 C12.+ | 22.4,33.83 U$5.3 | 46.48,45.57 C14.1 | 49.99,46.71 v49.99,46.33 49.92,46.39 U1.24 | 56.42,46.32 56.41,46.3 | 56.74,47.37 56.74,47.46 U1.14 U1.13 | v97.08,42.67 97.08,47.09 R27.2
  Top 0.813: v49.99,46.33 49.99,45.01 50.75,44.25 51.82,44.25 52.07,43.99 55.24,43.99 56.19,44.93 56.19,46.08 56.41,46.3 | 56.42,46.32 56.79,46.69 56.79,47.32 56.74,47.37
  Top 1.016: v21.18,21.18 20.27,22.1 | 41.76,45.57 46.18,45.57 C14.1 | 24.99,36.42 22.55,33.98 U$5.3 | C13.1 41.45,45.57 40.79,45.57 37.95,42.72 35.15,42.72 31.6,39.17 25.65,39.17 25.04,38.56 C16.1 | 3.5,29.11 8.53,29.11 8.53,32.05 12.45,35.97 18.47,35.97 20.6,33.83 | 22.4,33.83 20.6,33.83 | 46.48,45.57 v48.01,45.57 | D2.1 22.11,18.1 v22.15,18.06 | v30.94,21.18 30.94,20.63 C22.1 | 20.6,33.83 19.41,33.83 v19,33.43 | v10.34,15.98 7.26,12.9 S3.3
  Bottom 0.406: v97.08,42.67 97.08,7.62 93.88,4.42 93.88,2.44 93.12,1.68 71.48,1.68 43.89,29.26 43.89,29.57 42.98,30.48 42.06,30.48 39.01,27.43 39.01,26.67 33.83,21.49 31.39,21.49 v30.94,21.18
  Bottom 1.016: v49.99,46.33 48.77,46.33 v48.01,45.57 | v21.18,21.18 22.15,20.22 v22.15,18.06 20.07,15.98 v10.34,15.98 | v21.18,21.18 v30.94,21.18 30.96,21.21 | v19,33.43 19,33.05 20.62,31.42 20.62,21.74 v21.18,21.18
VIN
  Top 1.016: 15.77,3.86 L2.1 | L2.1 22.62,3.39 C21.1 32.03,9.95 32.46,10.21 33.83,11.58 IC2.5 35.43,11.56 35.43,8.89 40.21,4.11 C10.+ | S3.1 13.86,5.77 L2.1
VS1
  Top 0.406: U$9.VS 3.66,79.4 3.96,79.1 C23.1 8.53,79.1 14.02,79.1 15.39,77.72 15.85,77.72 R19.2
VS2
  Top 0.406: R20.2 21.95,89.46 C24.1 21.95,89.61 22.25,89.92 22.25,94.49 U$8.VS
VS3
  Top 0.406: U$7.VS 73.76,96.47 71.48,94.18 71.48,92.35 R21.2 71.63,92.66 74.68,89.61 77.42,89.61 78.79,90.98 C25.1
VS4
  Top 0.406: R22.2 96.32,89.31 96.32,85.5 U$6.VS 96.16,85.5 95.86,85.19 91.9,85.19 C26.1
VSW  (via drill 0.6)
  Top 0.406: 16,13.41 16.15,13.26 L2.2 16.31,13.11 | 16,17.98 D2.2
  Top 1.016: 16,13.41 15.9,13.51 D2.2 | v20.73,8.69 20.73,8.7 L2.2 | v31.7,12.62 32.84,12.62 33.5,13.28 IC2.4
  Bottom 1.016: v20.73,8.69 27.84,1.57 28.98,1.57 31.7,4.29 v31.7,12.62
VUSB  (via drill 0.51)
  Top 0.406: v51.36,58.98 51.36,67.51 U$1.7 | v66.45,24.54 71.32,19.66 C8.1 71.48,19.51 71.48,16 F1.1 71.63,15.85 73.61,13.87 75.44,13.87 C9.1 | v71.32,29.41 74.98,29.41 77.57,26.82 77.57,22.55 79.7,20.42 80.16,20.42 T2.1
  Bottom 0.406: v66.45,24.54 66.45,29.41 | 66.45,29.41 66.45,37.95 57.48,46.91 57.48,47.19 53.75,50.93 53.75,52.58 49.63,52.58 49.33,52.88 49.33,55.58 51.36,57.61 v51.36,58.98 | 66.45,29.41 v71.32,29.41